# Altium project OpenPLCv0.2.0.PrjPcb (part 2 of 3)

## Sheet OpenPLCv0.2.0_Watchdog.SchDoc
size 420 x 297 mm; PageSetup: Record=PageOptions|CenterHorizontal=True|CenterVertical=True|PrintScale=1.01|XCorrection=1.00|YCorrection=1.00|PrintKind=1|BorderSize=5000000|LeftOffset=0|BottomOffset=0|Orientation=2|PaperLength=1000|PaperWidth=1000|Scale=100|PaperSource=7|PrintQuality=-4|MediaType=1|DitherType=10|PaperKind=A3|PrintScaleMode=1; DocumentNumber: 20; SheetNumber: 20; SheetTotal: 22; SheetTitle: Watchdog Timer
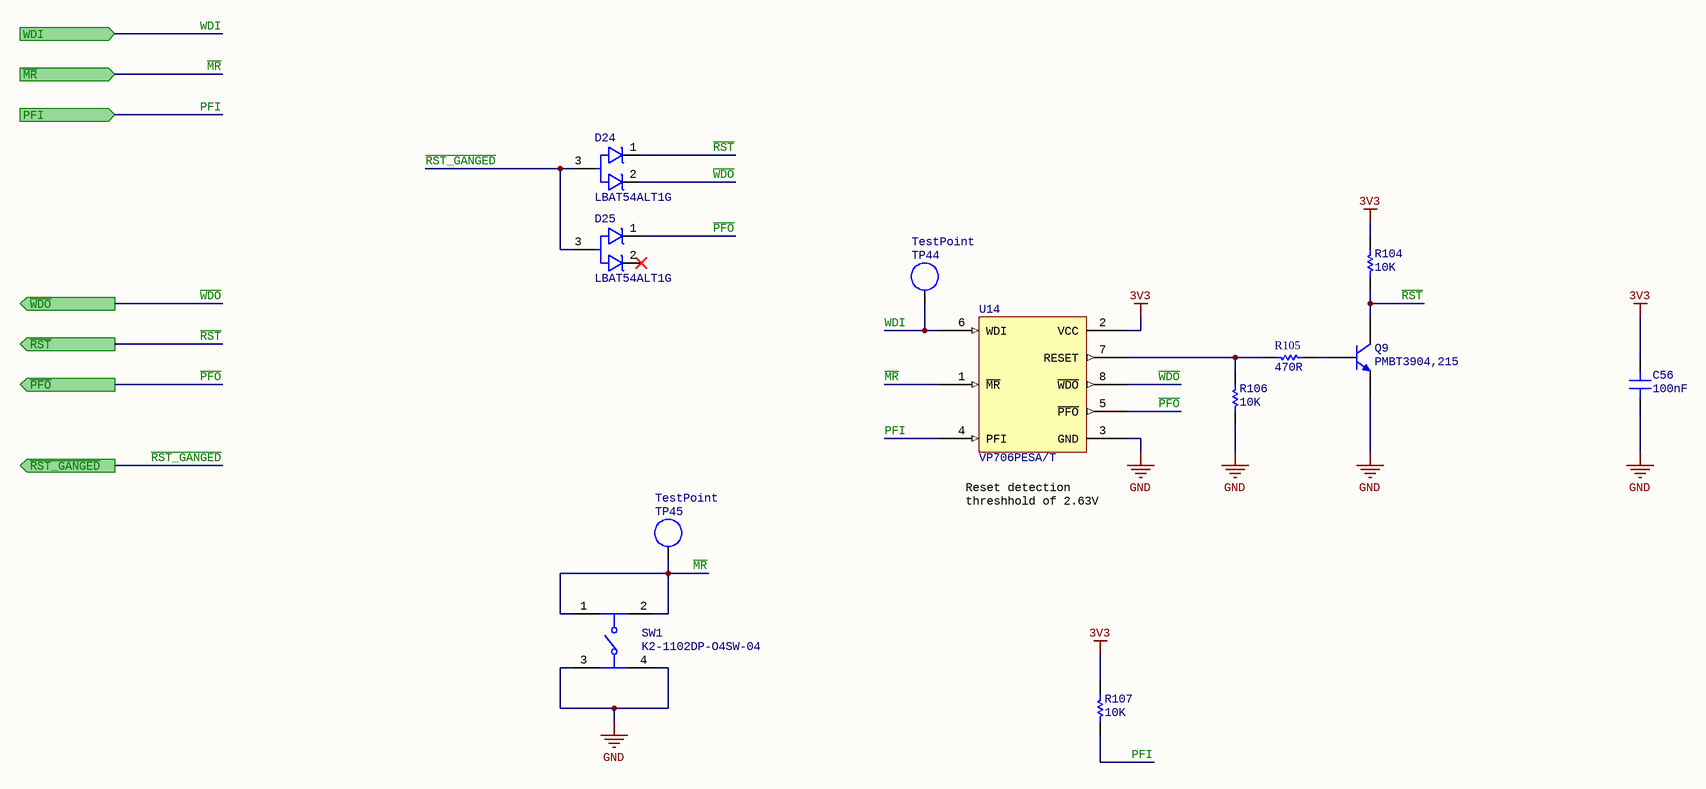
[diagram p8: OpenPLCv0.2.0_Watchdog.SchDoc]

### Parts
C56  Capacitance: 100nF  [SMD_CAP_0402(1005)_N]  (hidden comment: CC0402KRX5R6BB104)
D24  LBAT54ALT1G  [SOT23-3]
D25  LBAT54ALT1G  [SOT23-3]
Q9  PMBT3904,215  [SOT23-3]
R104  Resistance: 10K  [SMD_RES_0402(1005)_N]  (hidden comment: RC0402FR-0710KL)
R105  Resistance: 470R  [SMD_RES_0402(1005)_N]  (hidden comment: RC0402FR-07470RL)
R106  Resistance: 10K  [SMD_RES_0402(1005)_N]  (hidden comment: RC0402FR-0710KL)
R107  Resistance: 10K  [SMD_RES_0402(1005)_N]  (hidden comment: RC0402FR-0710KL)
SW1  K2-1102DP-O4SW-04  [K2-1102DP-O4SW-04]
TP44  TestPoint  [Pad]  (no BOM)
TP45  TestPoint  [Pad]  (no BOM)
U14  VP706PESA/T  [SOIC-8-3.9mm]

### Ports
PFI (in), WDI (in), ~{MR} (in), ~{PFO} (out), ~{RST_GANGED} (out), ~{RST} (out), ~{WDO} (out)

### Nets
3V3: C56.2 R104.2 R107.2 U14.2(VCC)
GND: C56.1 Q9.2(E) R106.1 SW1.3 SW1.4 U14.3(GND)
~{MR}: SW1.1 SW1.2 TP45.1 U14.1(~{MR}) ; port ~{MR}
~{PFO}: D25.1(CATHODE) U14.5(~{PFO}) ; port ~{PFO}
PFI: R107.1 U14.4(PFI) ; port PFI
~{RST}: D24.1(CATHODE) Q9.3(C) R104.1 ; port ~{RST}
~{RST_GANGED}: D24.3(ANODE) D25.3(ANODE) ; port ~{RST_GANGED}  [project net ~{RESET}]
~{WDO}: D24.2(CATHODE) U14.8(~{WDO}) ; port ~{WDO}
WDI: TP44.1 U14.6(WDI) ; port WDI  [project net LED]
NetQ9_1: Q9.1(B) R105.2
NetR105_1: R105.1 R106.2 U14.7(RESET)

Not connected (* = marked no-connect by the designer): D25 2(CATHODE)*

### Notes on the sheet
- (near U14) Reset detection threshhold of 2.63V
- FILE NAME
- PROJECT
- TITLE
- REV
- AUTHOR
- SIZE
- SHEET
- DATE
- OF
- A3

### Library data of the parts
C56 = 100nF 0402 10V 10%: as C3 on sheet OpenPLCv0.2.0_AnalogueOutput; Package: 0402; Tolerance: 10%; Voltage Rating: 10V
D24 D25 = LBAT54ALT1G: 30V 200mA 320mV @ 1mA SOT-23(SOT-23-3) Schottky Barrier Diodes (SBD) RoHS
Q9 = PMBT3904,215: as Q10 on sheet OpenPLCv0.2.0_TopLevel
R104 R106 R107 = 10K 0402 1% 1/16W: as R79 on sheet OpenPLCv0.2.0_TopLevel; Package: 0402; Tolerance: 1%; Power Rating: 1/16W
R105 = 470R 0402 1% 1W: as R43 on sheet OpenPLCv0.2.0_ComputeModule; Package: 0402; Tolerance: 1%
SW1 = K2-1102DP-O4SW-04: 6x6x11mm Through Hole Tactile Switches ROHS
TP44 TP45 = Test point
U14 = VP706PESA/T: SIOC-8 Monitors & Reset Circuits ROHS, 2.63V, -40°C to 85°C (copy of MAX706P)

## Sheet OpenPLCv0.2.0_AnalogueInput.SchDoc
size 420 x 297 mm; PageSetup: Record=PageOptions|CenterHorizontal=True|CenterVertical=True|PrintScale=1.01|XCorrection=1.00|YCorrection=1.00|PrintKind=1|BorderSize=5000000|LeftOffset=0|BottomOffset=0|Orientation=2|PaperLength=1000|PaperWidth=1000|Scale=100|PaperSource=7|PrintQuality=-4|MediaType=1|DitherType=10|PaperKind=A3|PrintScaleMode=1; DocumentNumber: 5; SheetNumber: 5; SheetTotal: 22; SheetTitle: Analogue Input
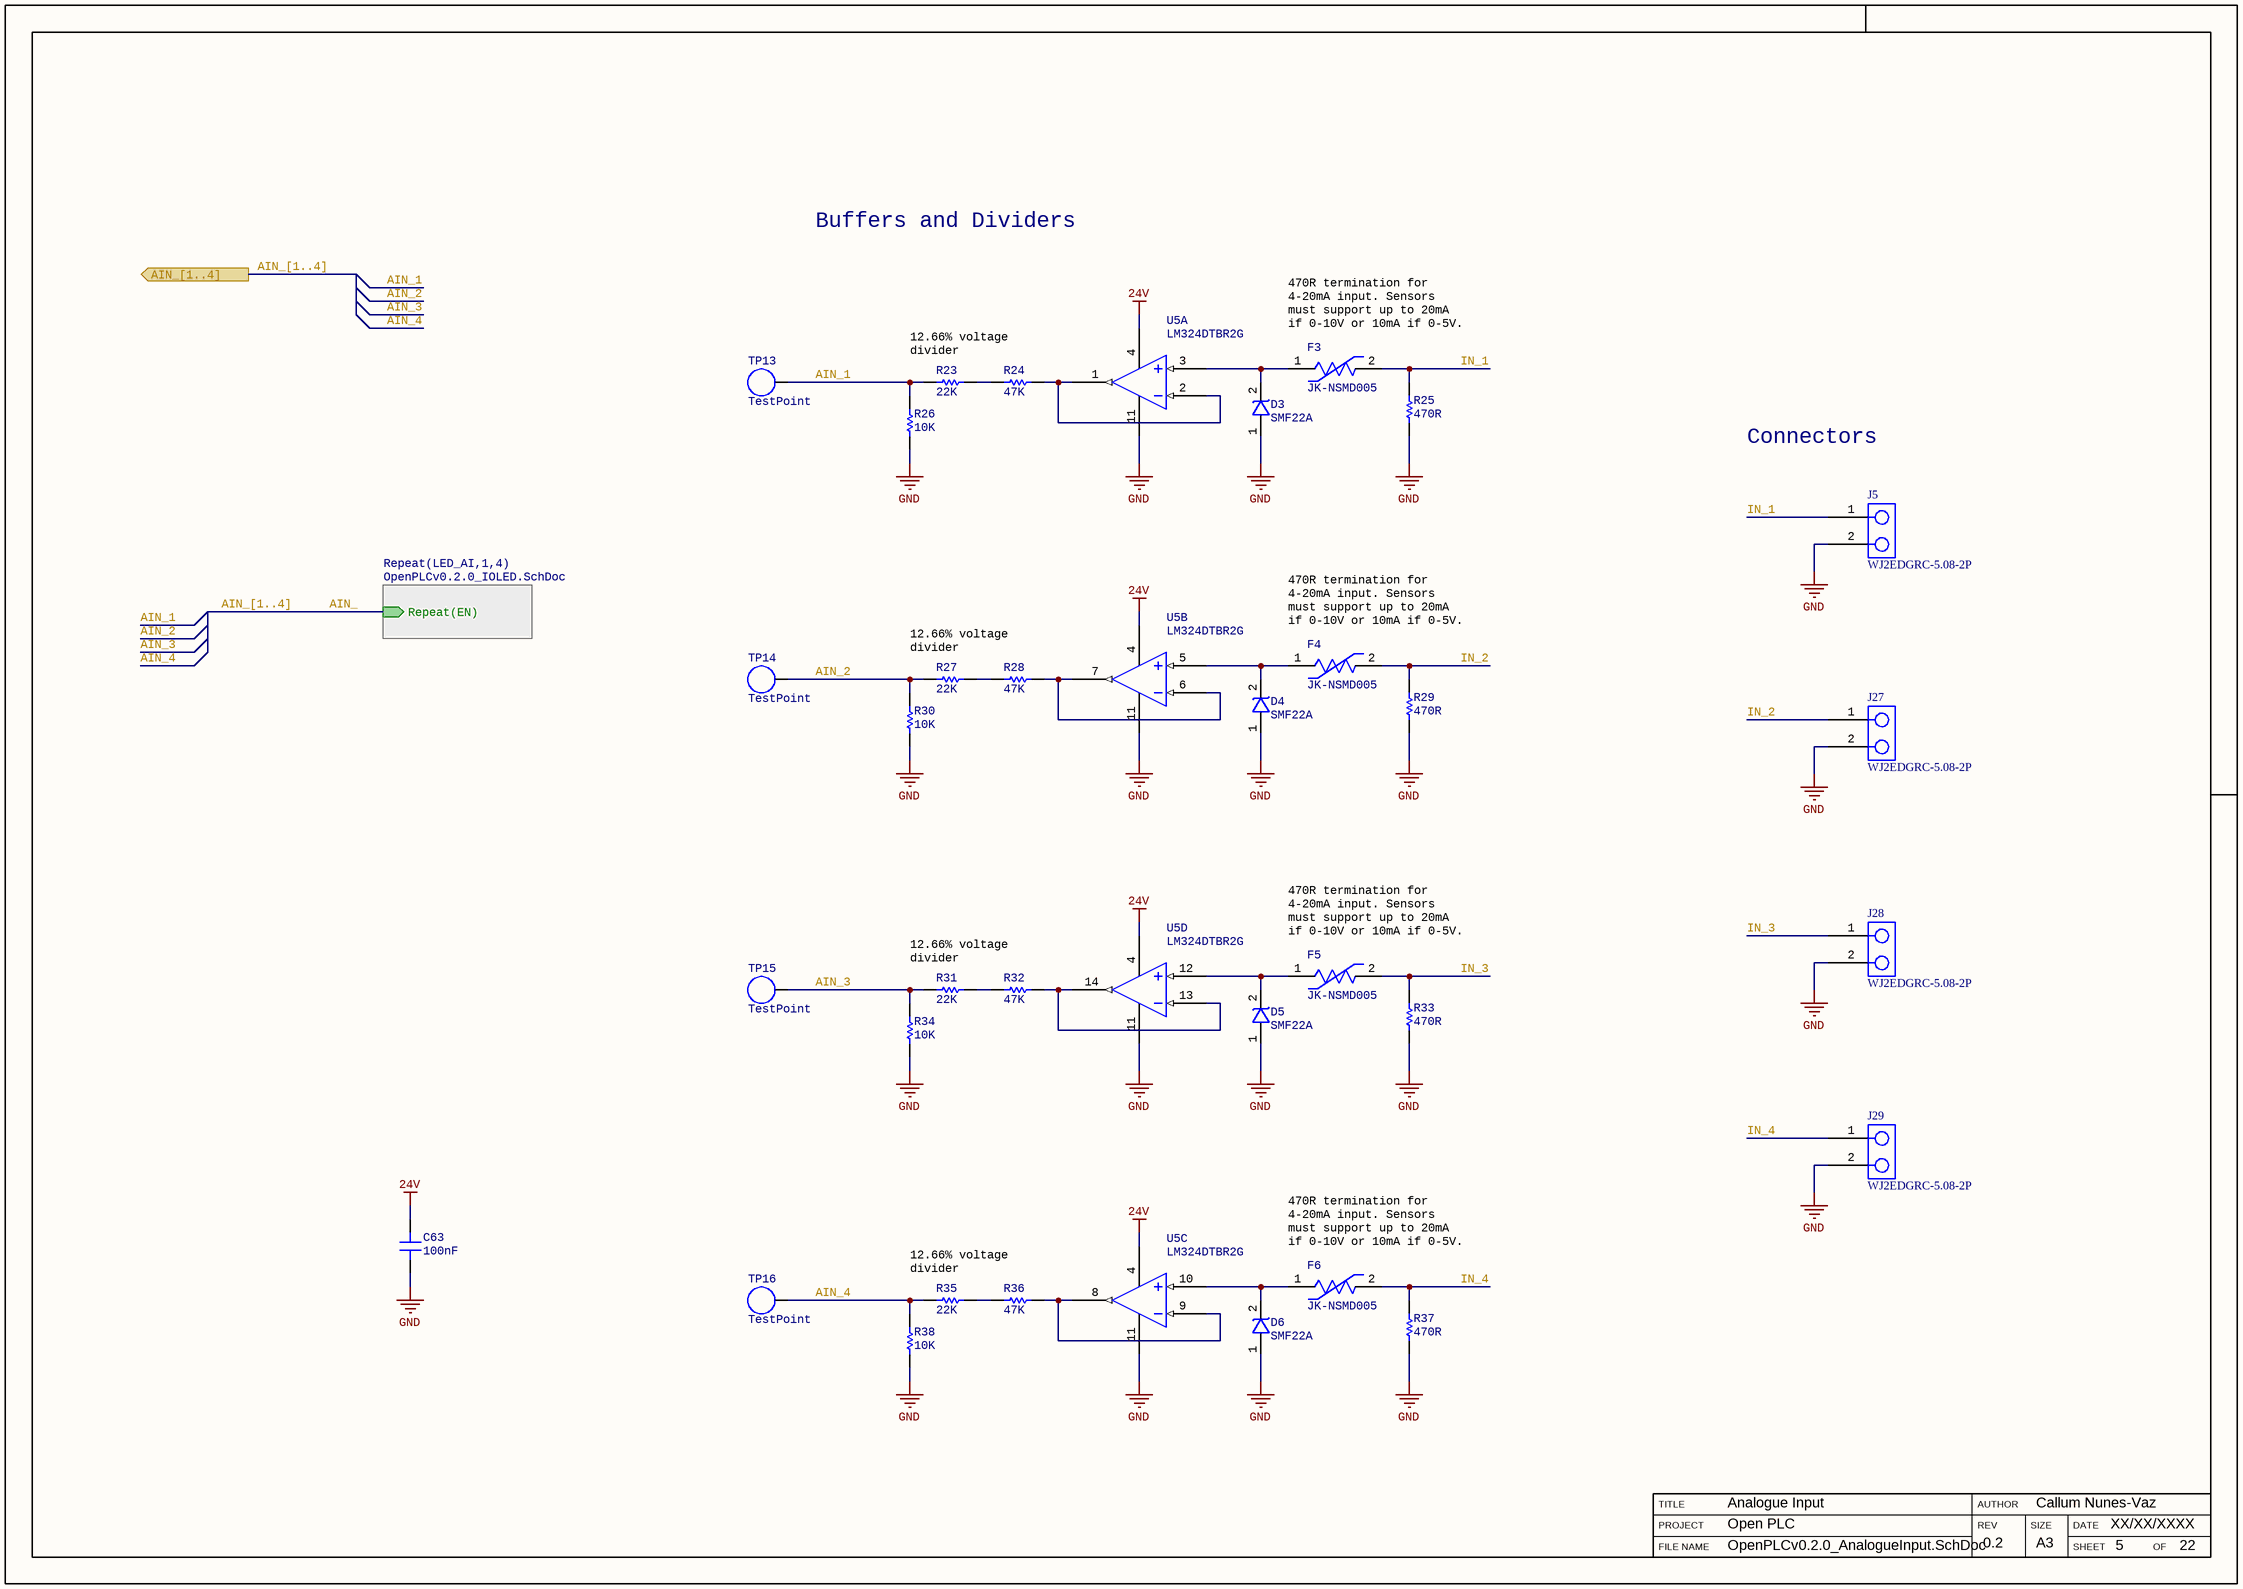
[diagram p9: OpenPLCv0.2.0_AnalogueInput.SchDoc]

### Parts
C63  Capacitance: 100nF  [SMD_CAP_0402(1005)_N]  (hidden comment: CC0402KRX5R9BB104)
D3  SMF22A  [SOD-123FL]
D4  SMF22A  [SOD-123FL]
D5  SMF22A  [SOD-123FL]
D6  SMF22A  [SOD-123FL]
F3  JK-NSMD005  [SMD_RES_1206(3216)_N]
F4  JK-NSMD005  [SMD_RES_1206(3216)_N]
F5  JK-NSMD005  [SMD_RES_1206(3216)_N]
F6  JK-NSMD005  [SMD_RES_1206(3216)_N]
J5  WJ2EDGRC-5.08-2P  [796638-2_BoardEdgeAlt]
J27  WJ2EDGRC-5.08-2P  [796638-2_BoardEdgeAlt]
J28  WJ2EDGRC-5.08-2P  [796638-2_BoardEdgeAlt]
J29  WJ2EDGRC-5.08-2P  [796638-2_BoardEdgeAlt]
R23  Resistance: 22K  [SMD_RES_0402(1005)_N]  (hidden comment: RC0402FR-0722KL)
R24  Resistance: 47K  [SMD_RES_0402(1005)_N]  (hidden comment: RC0402FR-0747KL)
R25  Resistance: 470R  [SMD_RES_2512(6432)_N]  (hidden comment: AC2512FK-07470RL)
R26  Resistance: 10K  [SMD_RES_0402(1005)_N]  (hidden comment: RC0402FR-0710KL)
R27  Resistance: 22K  [SMD_RES_0402(1005)_N]  (hidden comment: RC0402FR-0722KL)
R28  Resistance: 47K  [SMD_RES_0402(1005)_N]  (hidden comment: RC0402FR-0747KL)
R29  Resistance: 470R  [SMD_RES_2512(6432)_N]  (hidden comment: AC2512FK-07470RL)
R30  Resistance: 10K  [SMD_RES_0402(1005)_N]  (hidden comment: RC0402FR-0710KL)
R31  Resistance: 22K  [SMD_RES_0402(1005)_N]  (hidden comment: RC0402FR-0722KL)
R32  Resistance: 47K  [SMD_RES_0402(1005)_N]  (hidden comment: RC0402FR-0747KL)
R33  Resistance: 470R  [SMD_RES_2512(6432)_N]  (hidden comment: AC2512FK-07470RL)
R34  Resistance: 10K  [SMD_RES_0402(1005)_N]  (hidden comment: RC0402FR-0710KL)
R35  Resistance: 22K  [SMD_RES_0402(1005)_N]  (hidden comment: RC0402FR-0722KL)
R36  Resistance: 47K  [SMD_RES_0402(1005)_N]  (hidden comment: RC0402FR-0747KL)
R37  Resistance: 470R  [SMD_RES_2512(6432)_N]  (hidden comment: AC2512FK-07470RL)
R38  Resistance: 10K  [SMD_RES_0402(1005)_N]  (hidden comment: RC0402FR-0710KL)
TP13  TestPoint  [Pad]  (no BOM)
TP14  TestPoint  [Pad]  (no BOM)
TP15  TestPoint  [Pad]  (no BOM)
TP16  TestPoint  [Pad]  (no BOM)
U5  LM324DTBR2G  [TSSOP-14]  (parts A,B,C,D of 4)

### Sub-sheets
Repeat(LED_AI,1,4) = OpenPLCv0.2.0_IOLED.SchDoc: Repeat(EN) (in)

### Ports
AIN_[1..4] (out)

### Nets
24V: C63.2 U5.4(VDD)
GND: C63.1 D3.1(ANODE) D4.1(ANODE) D5.1(ANODE) D6.1(ANODE) J5.2 J27.2 J28.2 J29.2 R25.1 R26.2 R29.1 R30.2 R33.1 R34.2 R37.1 R38.2 U5.11(VSS)
AIN_: sheet Repeat(LED_AI,1,4)/Repeat(EN)
AIN_1: R23.1 R26.1 TP13.1  [project net ADC_IN1]
AIN_2: R27.1 R30.1 TP14.1  [project net ADC_IN2]
AIN_3: R31.1 R34.1 TP15.1  [project net ADC_IN3]
AIN_4: R35.1 R38.1 TP16.1  [project net ADC_IN4]
IN_1: F3.2 J5.1 R25.2
IN_2: F4.2 J27.1 R29.2
IN_3: F5.2 J28.1 R33.2
IN_4: F6.2 J29.1 R37.2
NetD3_2: D3.2(CATHODE) F3.1 U5.3(VIN+)
NetD4_2: D4.2(CATHODE) F4.1 U5.5(VIN+)
NetD5_2: D5.2(CATHODE) F5.1 U5.12(VIN+)
NetD6_2: D6.2(CATHODE) F6.1 U5.10(VIN+)
NetR23_2: R23.2 R24.2
NetR24_1: R24.1 U5.1(VOUT) U5.2(VIN-)
NetR27_2: R27.2 R28.2
NetR28_1: R28.1 U5.6(VIN-) U5.7(VOUT)
NetR31_2: R31.2 R32.2
NetR32_1: R32.1 U5.13(VIN-) U5.14(VOUT)
NetR35_2: R35.2 R36.2
NetR36_1: R36.1 U5.8(VOUT) U5.9(VIN-)

### Buses and harness runs
bus AIN_[1..4]
bus AIN_[1..4] = port AIN_[1..4]

### Notes on the sheet
- Buffers and Dividers
- (near F3) 470R termination for 4-20mA input. Sensors must support up to 20mA if 0-10V or 10mA if 0-5V.
- 12.66% voltage divider
- Connectors
- (near F4) 470R termination for 4-20mA input. Sensors must support up to 20mA if 0-10V or 10mA if 0-5V.
- (near F5) 470R termination for 4-20mA input. Sensors must support up to 20mA if 0-10V or 10mA if 0-5V.
- (near F6) 470R termination for 4-20mA input. Sensors must support up to 20mA if 0-10V or 10mA if 0-5V.
- FILE NAME
- PROJECT
- TITLE
- REV
- AUTHOR
- SIZE
- SHEET
- DATE
- OF
- A3

### Library data of the parts
C63 = 100nF 0402 50V 10%: 100nF ±10% 50V X5R 0402 Multilayer Ceramic Capacitors MLCC - SMD/SMT RoHS; Package: 0402; Tolerance: 10%; Voltage Rating: 50V
D3-D6 = SMF22A: Unidirectional 22V 24.4V 35.5V 5.6A SOD-123F TVS RoHS
F3-F6 = JK-NSMD005: 60V 150mA 1.5s 1206 PTC Resettable Fuses RoHS
J5 J27-J29 = WJ2EDGRC-5.08-2P: Covered（4Sided） 2 1 0.200"（5.08mm） 2 P=5.08mm Pluggable System Terminal Block RoHS
R23 R27 R31 R35 = 22K 0402 1% 1/16W: 22kΩ ±1% 1/16W ±100ppm/℃ 0402 Chip Resistor - Surface Mount RoHS; Package: 0402; Tolerance: 1%; Power Rating: 1/16W
R24 R28 R32 R36 = 47K 0402 1% 1/16W: 47kΩ ±1% 1/16W ±100ppm/℃ 0402 Chip Resistor - Surface Mount RoHS; Package: 0402; Tolerance: 1%; Power Rating: 1/16W
R25 R29 R33 R37 = 470R 2512 1% 1W: 470Ω ±1% 1W ±100ppm/℃ 2512 Chip Resistor - Surface Mount RoHS; Package: 2512; Tolerance: 1%; Power Rating: 1W
R26 R30 R34 R38 = 10K 0402 1% 1/16W: 10kΩ ±1% 1/16W ±100ppm/℃ 0402 Chip Resistor - Surface Mount RoHS; Package: 0402; Tolerance: 1%; Power Rating: 1/16W
TP13-TP16 = Test point
U5 = LM324DTBR2G: General Purpose 4 3V ~ 32V, ±1.5V ~ 16V 1MHz 0.6 V/us TSSOP-14 Operational Amplifiers RoHS

## Sheet OpenPLCv0.2.0_Power.SchDoc
size 420 x 297 mm; PageSetup: Record=PageOptions|CenterHorizontal=True|CenterVertical=True|PrintScale=1.01|XCorrection=1.00|YCorrection=1.00|PrintKind=1|BorderSize=5000000|LeftOffset=0|BottomOffset=0|Orientation=2|PaperLength=1000|PaperWidth=1000|Scale=100|PaperSource=7|PrintQuality=-4|MediaType=1|DitherType=10|PaperKind=A3|PrintScaleMode=1; DocumentNumber: 3; SheetNumber: 3; SheetTotal: 22; SheetTitle: Power Regulation
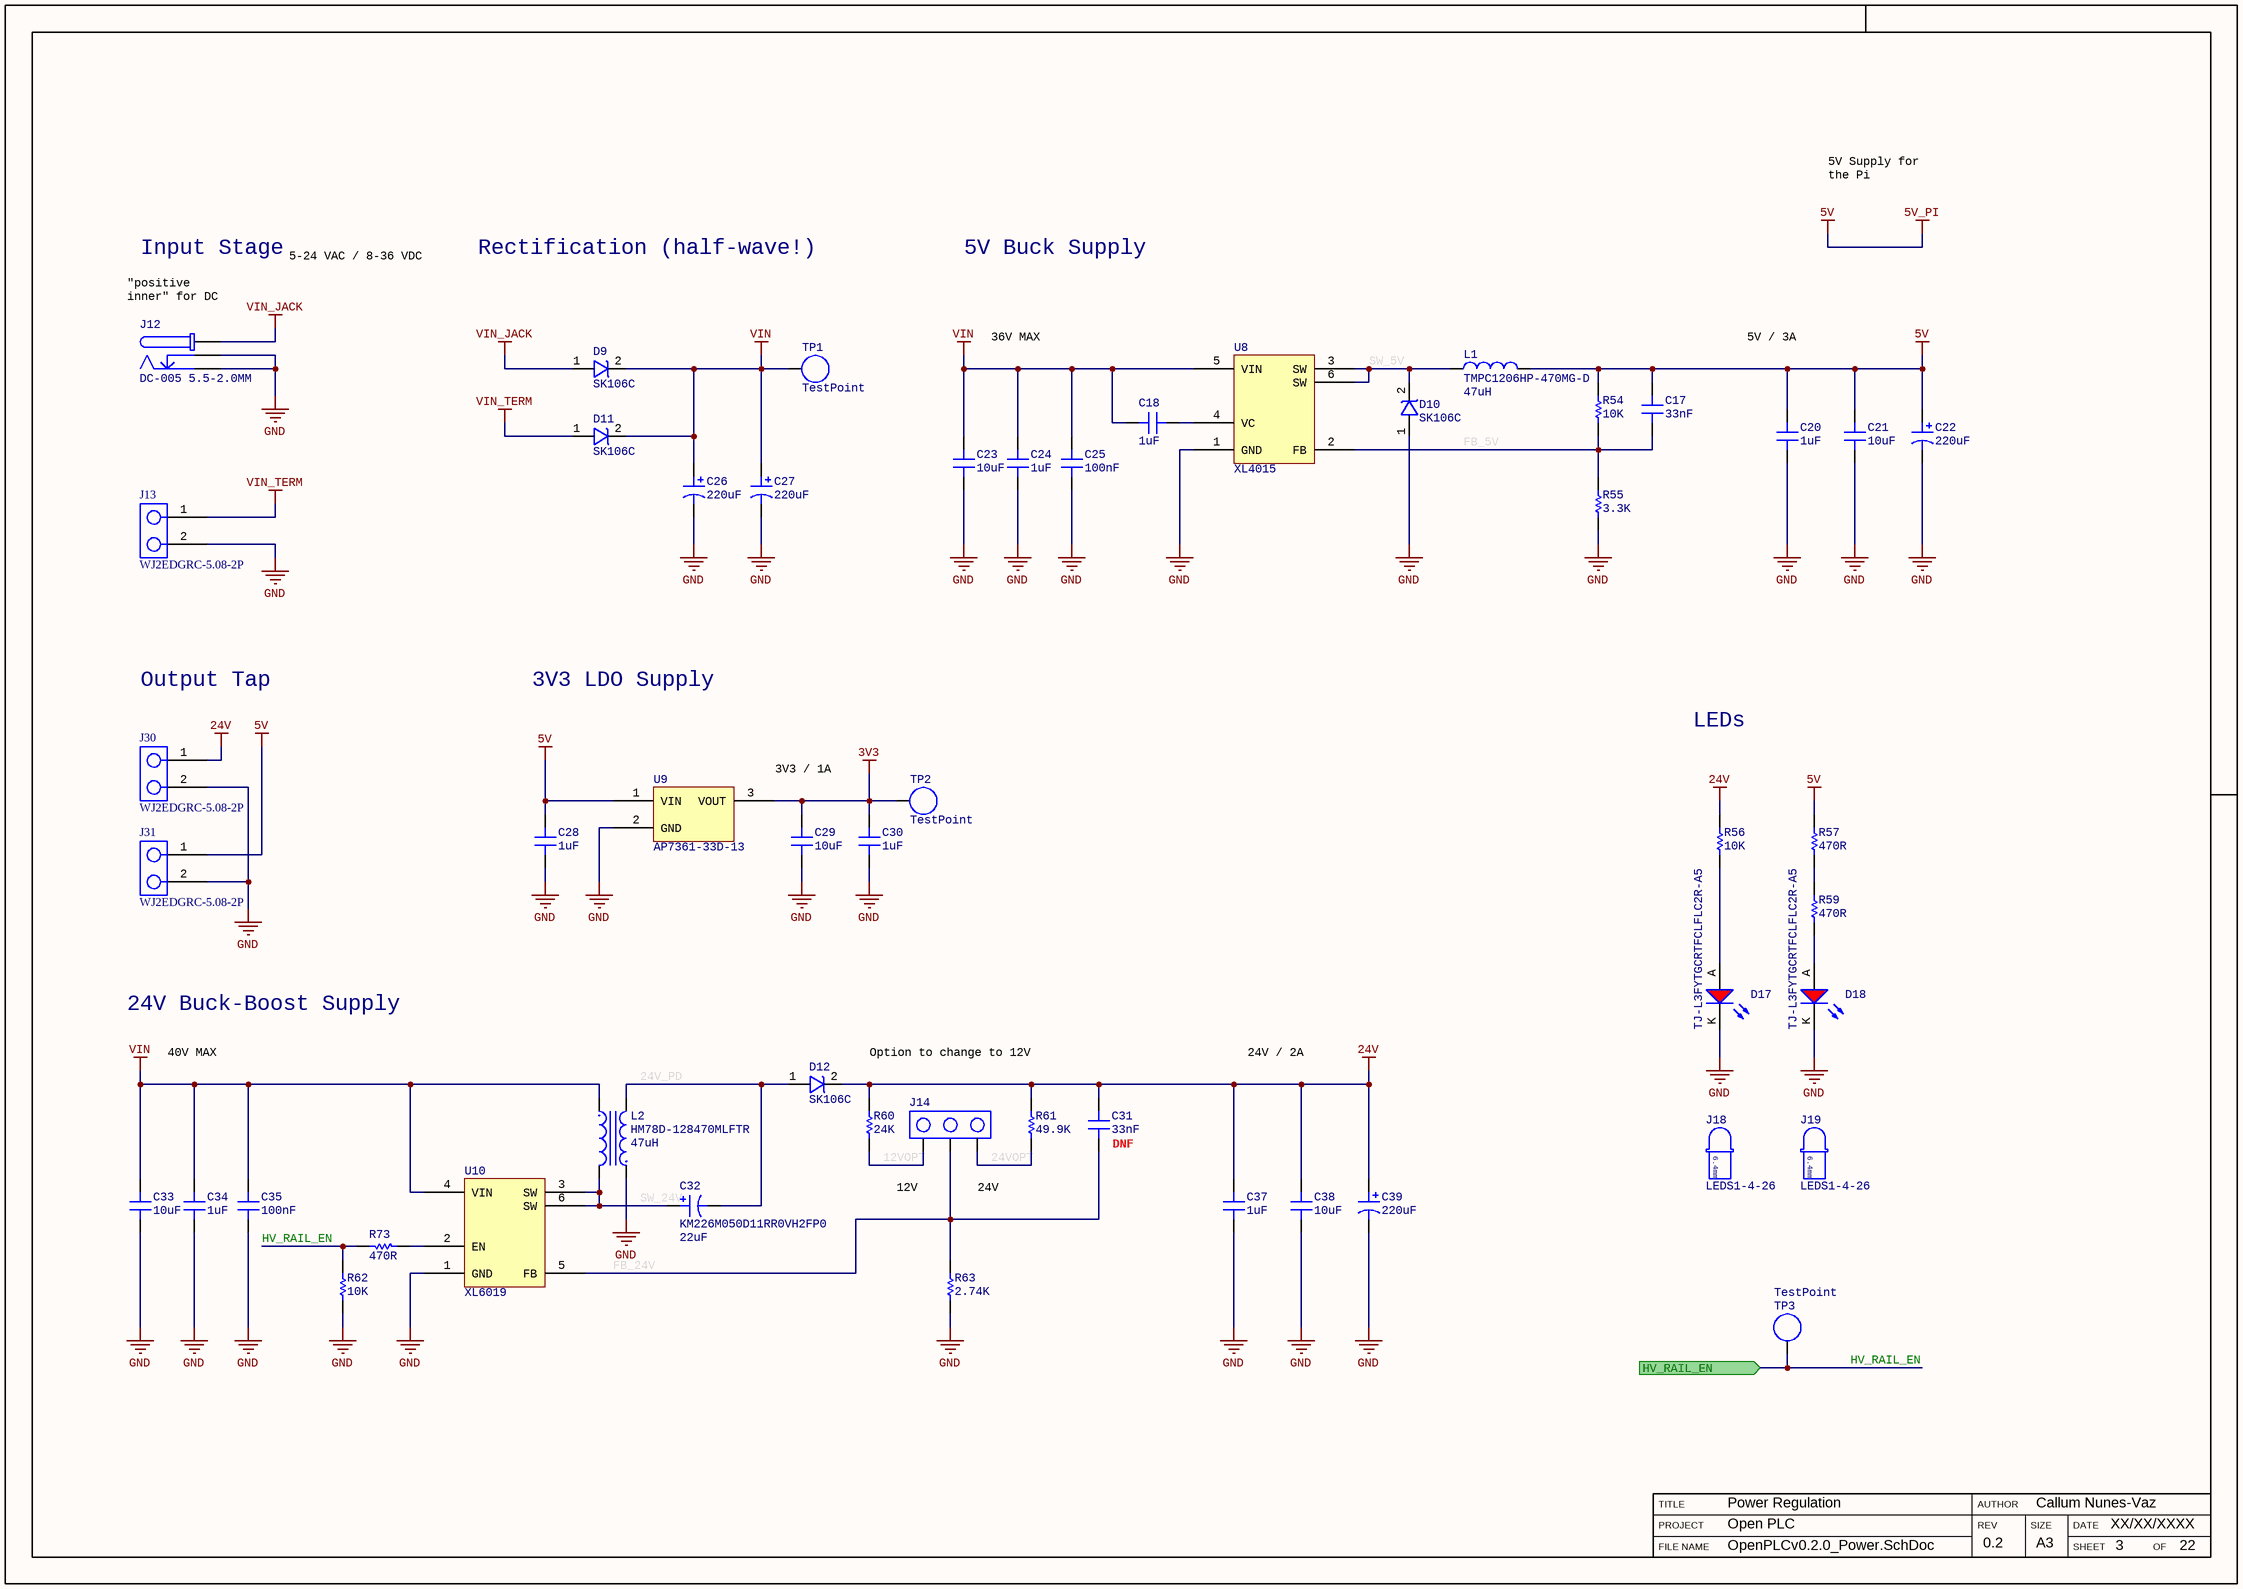
[diagram p10: OpenPLCv0.2.0_Power.SchDoc]

### Parts
C17  Capacitance: 33nF  [SMD_CAP_0402(1005)_N]  (hidden comment: CC0402KRX7R9BB333)
C18  Capacitance: 1uF  [SMD_CAP_0603(0201)_N]  (hidden comment: CC0603KRX5R9BB105)
C20  Capacitance: 1uF  [SMD_CAP_0603(0201)_N]  (hidden comment: CC0603KRX5R9BB105)
C21  Capacitance: 10uF  [SMD_CAP_1206(3216)_N]  (hidden comment: CC1206KKX5R9BB106)
C22  Capacitance: 220uF  [Electrolytic_D10mm_H12.5mm]  (hidden comment: ECR1HPT221MLL100012)
C23  Capacitance: 10uF  [SMD_CAP_1206(3216)_N]  (hidden comment: CC1206KKX5R9BB106)
C24  Capacitance: 1uF  [SMD_CAP_0603(0201)_N]  (hidden comment: CC0603KRX5R9BB105)
C25  Capacitance: 100nF  [SMD_CAP_0402(1005)_N]  (hidden comment: CC0402KRX5R9BB104)
C26  Capacitance: 220uF  [Electrolytic_D10mm_H12.5mm]  (hidden comment: ECR1HPT221MLL100012)
C27  Capacitance: 220uF  [Electrolytic_D10mm_H12.5mm]  (hidden comment: ECR1HPT221MLL100012)
C28  Capacitance: 1uF  [SMD_CAP_0603(0201)_N]  (hidden comment: CC0603KRX5R9BB105)
C29  Capacitance: 10uF  [SMD_CAP_1206(3216)_N]  (hidden comment: CC1206KKX5R9BB106)
C30  Capacitance: 1uF  [SMD_CAP_0603(0201)_N]  (hidden comment: CC0603KRX5R9BB105)
C31  Capacitance: 33nF  [SMD_CAP_0402(1005)_N]  (hidden comment: CC0402KRX7R9BB333)
C32  KM226M050D11RR0VH2FP0  Capacitance: 22uF  [Electrolytic_D5mm_H11mm]
C33  Capacitance: 10uF  [SMD_CAP_1206(3216)_N]  (hidden comment: CC1206KKX5R9BB106)
C34  Capacitance: 1uF  [SMD_CAP_0603(0201)_N]  (hidden comment: CC0603KRX5R9BB105)
C35  Capacitance: 100nF  [SMD_CAP_0402(1005)_N]  (hidden comment: CC0402KRX5R9BB104)
C37  Capacitance: 1uF  [SMD_CAP_0603(0201)_N]  (hidden comment: CC0603KRX5R9BB105)
C38  Capacitance: 10uF  [SMD_CAP_1206(3216)_N]  (hidden comment: CC1206KKX5R9BB106)
C39  Capacitance: 220uF  [Electrolytic_D10mm_H12.5mm]  (hidden comment: ECR1HPT221MLL100012)
D9  SK106C  [DO-214AB]
D10  SK106C  [DO-214AB]
D11  SK106C  [DO-214AB]
D12  SK106C  [DO-214AB]
D17  TJ-L3FYTGCRTFCLFLC2R-A5  [LED_3MM_SPACED_6.4MM_RED]
D18  TJ-L3FYTGCRTFCLFLC2R-A5  [LED_3MM_SPACED_6.4MM_RED]
J12  DC-005 5.5-2.0MM  [DC-005 5.5-2.0MM]
J13  WJ2EDGRC-5.08-2P  [796638-2_BoardEdgeAlt]
J14  12251103CNG0S115001  [Header_3POS]  (value not drawn)
J18  LEDS1-4-26  [3MM_LED_SPACER_6.4MM]
J19  LEDS1-4-26  [3MM_LED_SPACER_6.4MM]
J30  WJ2EDGRC-5.08-2P  [796638-2_BoardEdgeAlt]
J31  WJ2EDGRC-5.08-2P  [796638-2_BoardEdgeAlt]
L1  TMPC1206HP-470MG-D  Inductance: 47uH  [TMPC1206HP-470MG-D]
L2  HM78D-128470MLFTR  Parallel Inductance: 47uH  [HM78D-128470MLFTR]
R54  Resistance: 10K  [SMD_RES_0402(1005)_N]  (hidden comment: RC0402FR-0710KL)
R55  Resistance: 3.3K  [SMD_RES_0402(1005)_N]  (hidden comment: RC0402FR-073K3L)
R56  Resistance: 10K  [SMD_RES_0402(1005)_N]  (hidden comment: RC0402FR-0710KL)
R57  Resistance: 470R  [SMD_RES_0402(1005)_N]  (hidden comment: RC0402FR-07470RL)
R59  Resistance: 470R  [SMD_RES_0402(1005)_N]  (hidden comment: RC0402FR-07470RL)
R60  Resistance: 24K  [SMD_RES_0402(1005)_N]  (hidden comment: RC0402FR-0724KL)
R61  Resistance: 49.9K  [SMD_RES_0402(1005)_N]  (hidden comment: RC0402FR-0749K9L)
R62  Resistance: 10K  [SMD_RES_0402(1005)_N]  (hidden comment: RC0402FR-0710KL)
R63  Resistance: 2.74K  [SMD_RES_0402(1005)_N]  (hidden comment: RC0402FR-072K74L)
R73  Resistance: 470R  [SMD_RES_0402(1005)_N]  (hidden comment: RC0402FR-07470RL)
TP1  TestPoint  [Pad]  (no BOM)
TP2  TestPoint  [Pad]  (no BOM)
TP3  TestPoint  [Pad]  (no BOM)
U8  XL4015  [TO-263-5]
U9  AP7361-33D-13  [TO-252]
U10  XL6019  [TO-263-5]

### Ports
HV_RAIL_EN (in)

### Nets
3V3: C29.2 C30.2 TP2.1 U9.3(VOUT)
5V: C17.2 C20.2 C21.2 C22.1 C28.2 J31.1 L1.2 R54.2 R57.2 U9.1(VIN)  [also labelled 5V_PI]
24V: C31.2 C37.2 C38.2 C39.1 D12.2(CATHODE) J30.1 R56.2 R60.2 R61.2
GND: C20.1 C21.1 C22.2 C23.1 C24.1 C25.1 C26.2 C27.2 C28.1 C29.1 C30.1 C33.1 C34.1 C35.1 C37.1 C38.1 C39.2 D10.1(ANODE) D17.K D18.K J12.2 J12.3 J13.2 J30.2 J31.2 L2.1 R55.1 R62.1 R63.1 U8.1(GND) U9.2(GND) U10.1(GND)
VIN: C18.2 C23.2 C24.2 C25.2 C26.1 C27.1 C33.2 C34.2 C35.2 D9.2(CATHODE) D11.2(CATHODE) L2.2 TP1.1 U8.5(VIN) U10.4(VIN)
VIN_JACK: D9.1(ANODE) J12.4
VIN_TERM: D11.1(ANODE) J13.1
12VOPT: J14.1 R60.1
24V_PD: C32.2 D12.1(ANODE) L2.3
24VOPT: J14.3 R61.1
FB_5V: C17.1 R54.1 R55.2 U8.2(FB)
FB_24V: C31.1 J14.2 R63.2 U10.5(FB)
HV_RAIL_EN: R62.2 R73.1 TP3.1 ; port HV_RAIL_EN  [project net EXP_GPIO5]
SW_5V: D10.2(CATHODE) L1.1 U8.3(SW) U8.6(SW)
SW_24V: C32.1 L2.4 U10.3(SW) U10.6(SW)
NetC18_1: C18.1 U8.4(VC)
NetD17_A: D17.A R56.1
NetD18_A: D18.A R59.1
NetR57_1: R57.1 R59.2
NetR73_2: R73.2 U10.2(EN)

### Notes on the sheet
- 5V Supply for the Pi
- Input Stage
- 5-24 VAC / 8-36 VDC
- Rectification (half-wave!)
- 5V Buck Supply
- (near J12) "positive inner" for DC Supplies
- 36V MAX
- 5V / 3A
- Output Tap
- 3V3 LDO Supply
- LEDs
- 3V3 / 1A
- 24V Buck-Boost Supply
- 40V MAX
- Option to change to 12V
- 24V / 2A
- 12V
- 24V (default)
- (near C31) DNF
- FILE NAME
- PROJECT
- TITLE
- REV
- AUTHOR
- SIZE
- SHEET
- DATE
- OF
- A3
- (in symbol LEDS1-4-26) 6.4mm

### Library data of the parts
C17 C31 = 33nF 0402 50V 10%: 33nF ±10% 50V X7R 0402 Multilayer Ceramic Capacitors MLCC - SMD/SMT RoHS; Package: 0402; Tolerance: 10%; Voltage Rating: 50V
C18 C20 C24 C28 C30 C34 C37 = 1uF 0603 50V 10%: 1uF ±10% 50V X5R 0603 Multilayer Ceramic Capacitors MLCC - SMD/SMT RoHS; Package: 0603; Tolerance: 10%; Voltage Rating: 50V
C21 C23 C29 C33 C38 = 10uF 1206 50V 10%: 10uF ±10% 50V X5R 1206 Multilayer Ceramic Capacitors MLCC - SMD/SMT RoHS; Package: 1206; Tolerance: 10%; Voltage Rating: 50V
C22 C26 C27 C39 = ECR1HPT221MLL100012: 5mm 220uF 50V 12.5mm 2000hrs 85℃ ±20% 10mm Radial Leaded,10x12.5mm Aluminum Electrolytic Capacitors - Leaded ROHS; Voltage Max: 35V; Tolerance: 20%
C25 C35 = 100nF 0402 50V 10%: as C63 on sheet OpenPLCv0.2.0_AnalogueInput; Package: 0402; Tolerance: 10%; Voltage Rating: 50V
C32 = KM226M050D11RR0VH2FP0: 2mm 22uF 50V ±20% 5mm 11mm 79mA 120Hz 1000hrs 105℃ Radial Leaded,5x11mm Aluminum Electrolytic Capacitors - Leaded ROHS; Voltage Max: 35V; Tolerance: 20%
D9-D12 = SK106C: 60V 10A 850mV @ 10A SMC(DO-214AB) Schottky Barrier Diodes (SBD) RoHS
D17 D18 = TJ-L3FYTGCRTFCLFLC2R-A5: LED 3mm Red 620nm~630nm 1.8V~2.6V Through Hole Light Emitting Diodes (LED) RoHS C331031
J12 = DC-005 5.5-2.0MM: Through Hole AC/DC Power Plugs & Receptacles RoHS
J13 J30 J31 = WJ2EDGRC-5.08-2P: as J5 on sheet OpenPLCv0.2.0_AnalogueInput
J14 = 3-way Jumper: Pin Header 3 1 right-angle，180degrees 2.54mm Through Hole,P=2.54mm Pin Header & Female Header RoHS
J18 J19 = LEDS1-4-26: 3mm LED spacer 6.4mm height
L1 = TMPC1206HP-470MG-D: 47uH ±20% 5.5A 80mΩ SMD,13.5x12.5x5.7mm Power Inductors RoHS; Saturation Current: 7A; DC Resistance: 80mR; Current Max: 5.5A; Size: 13.5x12.5x5.7mm
L2 = HM78D-128470MLFTR: Coupled Inductors 47uH 20%; Current Max: 5.2A; DC Resistance: 90mR; Size: 12.5x12.5x8.05mm
R54 R56 R62 = 10K 0402 1% 1/16W: as R26 on sheet OpenPLCv0.2.0_AnalogueInput; Package: 0402; Tolerance: 1%; Power Rating: 1/16W
R55 = 3K3 0402 1% 1/16W: 3.3kΩ ±1% 1/16W ±100ppm/℃ 0402 Chip Resistor - Surface Mount RoHS; Package: 0402; Tolerance: 1%; Power Rating: 1/16W
R57 R59 R73 = 470R 0402 1% 1W: 470Ω ±1% 1/16W ±100ppm/℃ 0402 Chip Resistor - Surface Mount RoHS; Power Rating: 1W; Package: 0402; Tolerance: 1%
R60 = 24K 0402 1% 1/16W: 24kΩ ±1% 1/16W ±100ppm/℃ 0402 Chip Resistor - Surface Mount RoHS; Package: 0402; Tolerance: 1%; Power Rating: 1/16W
R61 = 49K9 0402 1% 1/16W: 49.9kΩ ±1% 1/16W ±100ppm/℃ 0402 Chip Resistor - Surface Mount RoHS; Package: 0402; Tolerance: 1%; Power Rating: 1/16W
R63 = 2K74 0402 1% 1/16W: 2.74kΩ ±1% 1/16W ±100ppm/℃ 0402 Chip Resistor - Surface Mount RoHS; Package: 0402; Tolerance: 1%; Power Rating: 1/16W
TP1-TP3 = Test point
U8 = XL4015: XLSEMI 5A 180KHz 36V Buck DC to DC Converter
U9 = AP7361-33D-13: Fixed 6V 3.3V 700mV @ 1A TO-252 Dropout Regulators(LDO) RoHS
U10 = XL6019: XLSEMI 180KHz 60V 5A Switching Current Boost / Buck-Boost / Inverting DC/DC Converter

## Sheet OpenPLCv0.2.0_USBPortTypeB.SchDoc
size 420 x 297 mm; PageSetup: Record=PageOptions|CenterHorizontal=True|CenterVertical=True|PrintScale=1.01|XCorrection=1.00|YCorrection=1.00|PrintKind=1|BorderSize=5000000|LeftOffset=0|BottomOffset=0|Orientation=2|PaperLength=1000|PaperWidth=1000|Scale=100|PaperSource=7|PrintQuality=-4|MediaType=1|DitherType=10|PaperKind=A3|PrintScaleMode=1; DocumentNumber: 16; SheetNumber: 16; SheetTotal: 22; SheetTitle: USB Type-B
Used 2 times, as channels USB_UFP_STM, USB_DFP_PI. Parts and nets are listed once, with the designators drawn on the sheet.
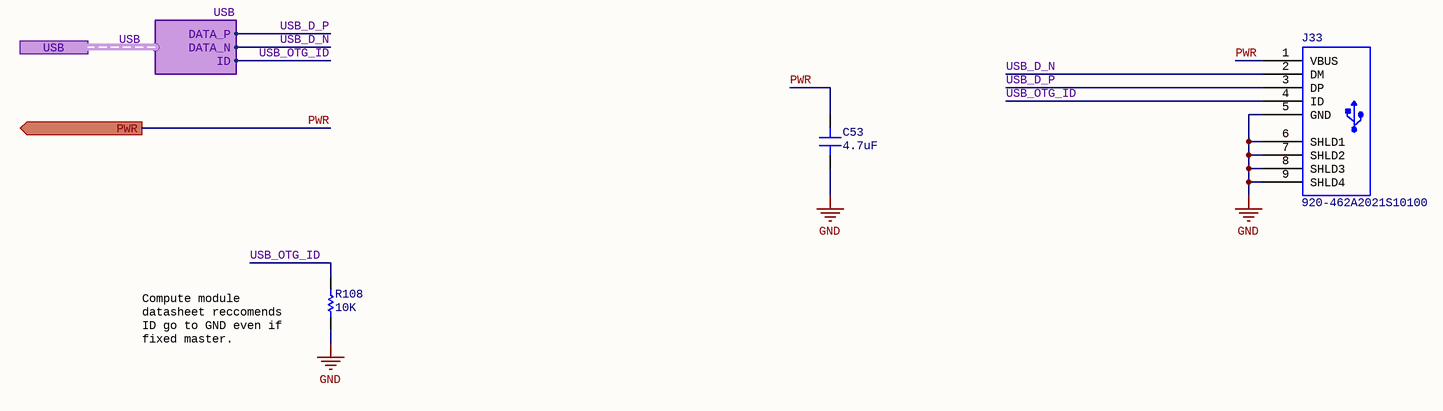
[diagram p11: OpenPLCv0.2.0_USBPortTypeB.SchDoc]

### Parts
C53  Capacitance: 4.7uF  [SMD_CAP_0603(0201)_N]  (hidden comment: CC0603KRX5R6BB475)
J33  920-462A2021S10100  [920-462A2021S10100]
R108  Resistance: 10K  [SMD_RES_0402(1005)_N]  (hidden comment: RC0402FR-0710KL)

### Ports
PWR (out), USB (harness USB)

### Harnesses
USB: DATA_P, DATA_N, ID

### Nets
GND: C53.1 J33.5(GND) J33.6(SHLD1) J33.7(SHLD2) J33.8(SHLD3) J33.9(SHLD4) R108.1
PWR: C53.2 J33.1(VBUS) ; port PWR
USB_D_N: J33.2(DM) ; port USB.DATA_N  [project net USB.DATA_N]
USB_D_P: J33.3(DP) ; port USB.DATA_P  [project net USB.DATA_P]
USB_OTG_ID: J33.4(ID) R108.2 ; port USB.ID  [project net USB.ID]

### Channels
USB_UFP_STM: designators end in _1; ports PWR=PWR_USB_UFP_STM
USB_DFP_PI: designators end in _2; ports PWR=PWR_USB_DFP_PI

### Buses and harness runs
harness USB = port USB

### Notes on the sheet
- (near R108) Compute module datasheet reccomends ID go to GND even if fixed master.
- FILE NAME
- PROJECT
- TITLE
- REV
- AUTHOR
- SIZE
- SHEET
- DATE
- OF
- A3

### Library data of the parts
C53 = 4.7uF 0603 10V 10%: 4.7uF ±10% 10V X5R 0603 Multilayer Ceramic Capacitors MLCC - SMD/SMT RoHS; Package: 0603; Tolerance: 10%; Voltage Rating: 10V
J33 = 920-462A2021S10100: USB - Mini B Female USB 2 5 SMD USB Connectors RoHS
R108 = 10K 0402 1% 1/16W: as R26 on sheet OpenPLCv0.2.0_AnalogueInput; Package: 0402; Tolerance: 1%; Power Rating: 1/16W

## Sheet OpenPLCv0.2.0_1Wire.SchDoc
size 420 x 297 mm; PageSetup: Record=PageOptions|CenterHorizontal=True|CenterVertical=True|PrintScale=1.01|XCorrection=1.00|YCorrection=1.00|PrintKind=1|BorderSize=5000000|LeftOffset=0|BottomOffset=0|Orientation=2|PaperLength=1000|PaperWidth=1000|Scale=100|PaperSource=7|PrintQuality=-4|MediaType=1|DitherType=10|PaperKind=A3|PrintScaleMode=1; DocumentNumber: 8; SheetNumber: 8; SheetTotal: 22; SheetTitle: 1-Wire Interface
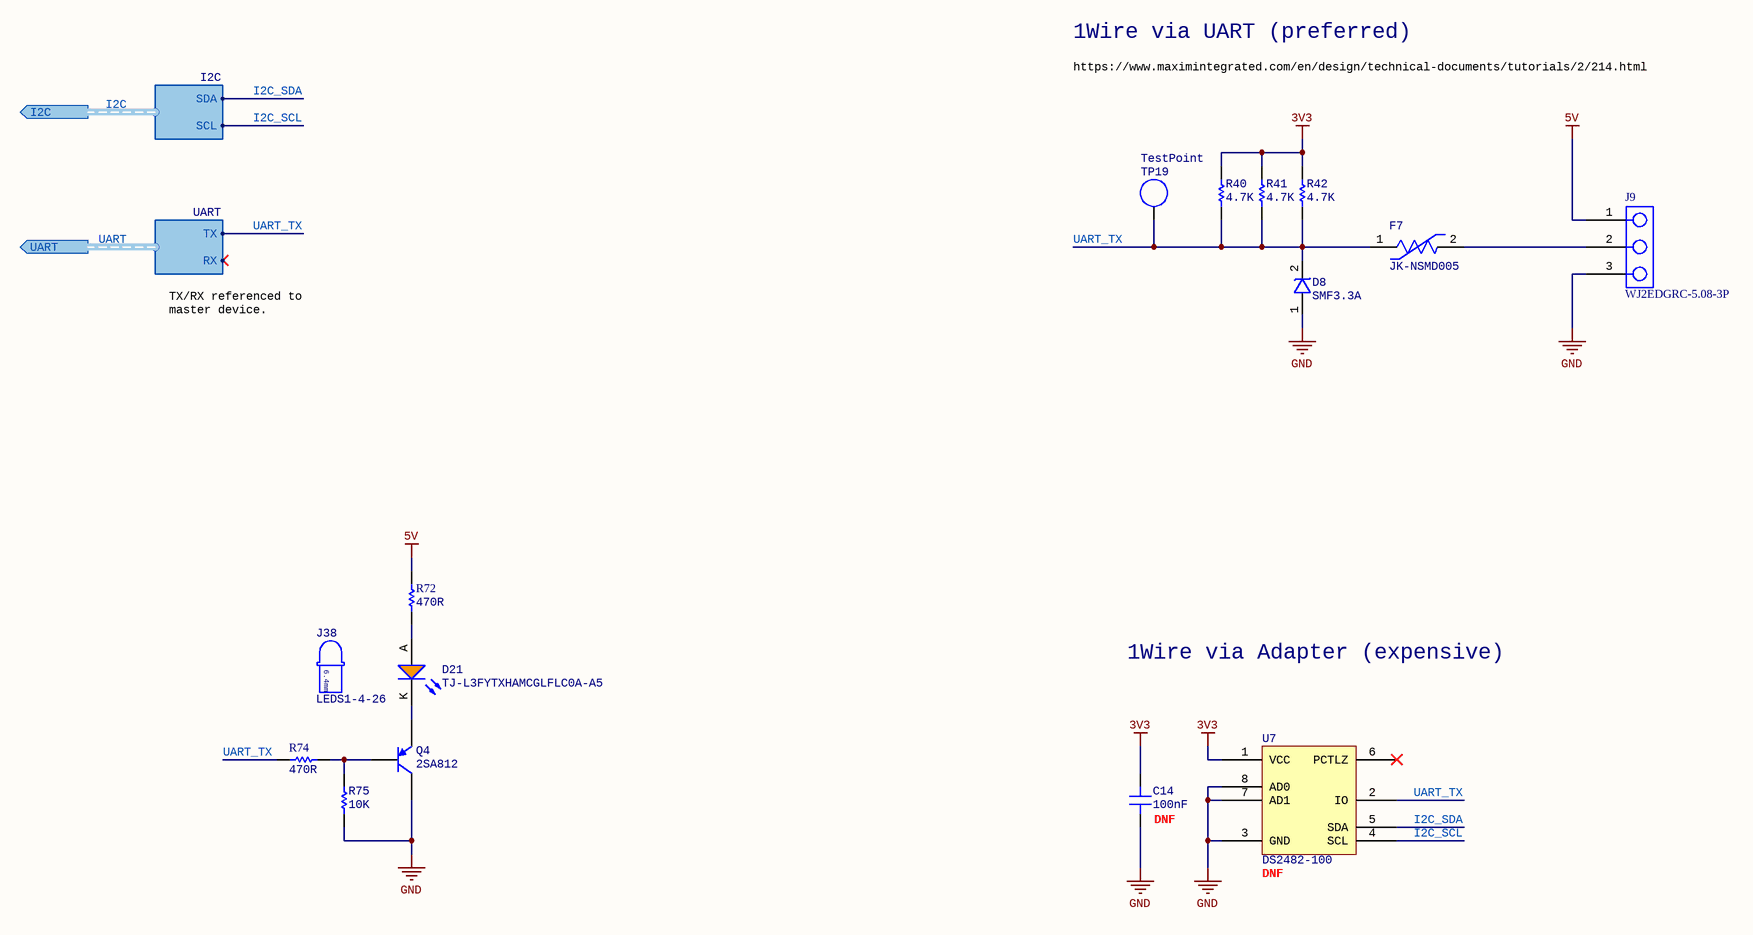
[diagram p12: OpenPLCv0.2.0_1Wire.SchDoc]

### Parts
C14  Capacitance: 100nF  [SMD_CAP_0402(1005)_N]  (hidden comment: CC0402KRX5R6BB104)
D8  SMF3.3A  [SOD-123FL]
D21  TJ-L3FYTXHAMCGLFLC0A-A5  [LED_3MM_SPACED_6.4MM_YELLOW]
F7  JK-NSMD005  [SMD_RES_1206(3216)_N]
J9  WJ2EDGRC-5.08-3P  [796638-3_BoardEdgeAlt]
J38  LEDS1-4-26  [3MM_LED_SPACER_6.4MM]
Q4  2SA812  [SOT23-3]
R40  Resistance: 4.7K  [SMD_RES_0402(1005)_N]  (hidden comment: RC0402FR-074K7L)
R41  Resistance: 4.7K  [SMD_RES_0402(1005)_N]  (hidden comment: RC0402FR-074K7L)
R42  Resistance: 4.7K  [SMD_RES_0402(1005)_N]  (hidden comment: RC0402FR-074K7L)
R72  Resistance: 470R  [SMD_RES_0402(1005)_N]  (hidden comment: RC0402FR-07470RL)
R74  Resistance: 470R  [SMD_RES_0402(1005)_N]  (hidden comment: RC0402FR-07470RL)
R75  Resistance: 10K  [SMD_RES_0402(1005)_N]  (hidden comment: RC0402FR-0710KL)
TP19  TestPoint  [Pad]  (no BOM)
U7  DS2482-100  [SOIC-8-3.9mm]

### Ports
I2C (out, harness I2C), UART (out, harness UART)

### Harnesses
I2C: SDA, SCL
UART: TX, RX

### Nets
3V3: C14.2 R40.2 R41.2 R42.2 U7.1(VCC)
5V: J9.1 R72.2
GND: C14.1 D8.1(ANODE) J9.3 Q4.3(E) R75.1 U7.3(GND) U7.7(AD1) U7.8(AD0)
I2C_SCL: U7.4(SCL) ; port I2C.SCL  [project net I2C.SCL]
I2C_SDA: U7.5(SDA) ; port I2C.SDA  [project net I2C.SDA]
UART_TX: D8.2(CATHODE) F7.1 R40.1 R41.1 R42.1 R74.2 TP19.1 U7.2(IO) ; port UART.TX  [project net STM_UART3.TX]
NetD21_A: D21.A R72.1
NetD21_K: D21.K Q4.2(C)
NetF7_2: F7.2 J9.2
NetQ4_1: Q4.1(B) R74.1 R75.2

Not connected (* = marked no-connect by the designer): U7 6(PCTLZ)*

### Buses and harness runs
harness I2C = port I2C
harness UART = port UART

### Notes on the sheet
- 1Wire via UART (preferred)
- https://www.maximintegrated.com/en/design/technical-documents/tutorials/2/214.html
- TX/RX referenced to master device.
- 1Wire via Adapter (expensive)
- (near C14) DNF
- (near U7) DNF
- FILE NAME
- PROJECT
- TITLE
- REV
- AUTHOR
- SIZE
- SHEET
- DATE
- OF
- A3
- (in symbol LEDS1-4-26) 6.4mm

### Library data of the parts
C14 = 100nF 0402 10V 10%: 100nF ±10% 10V X5R 0402 Multilayer Ceramic Capacitors MLCC - SMD/SMT RoHS; Package: 0402; Tolerance: 10%; Voltage Rating: 10V
D8 = SMF3.3A: Unidirectional 3.3V 5.2V 8V 25A SOD-123 TVS RoHS
D21 = TJ-L3FYTXHAMCGLFLC0A-A5: 600nm~610nm 1.8V~2.6V - - Through Hole Light Emitting Diodes (LED) ROHS 3mm
F7 = JK-NSMD005: as F3-F6 on sheet OpenPLCv0.2.0_AnalogueInput
J9 = WJ2EDGRC-5.08-3P: Covered（4Sided） 3 1 0.200"（5.08mm） 3 P=5.08mm Pluggable System Terminal Block RoHS
J38 = LEDS1-4-26: 3mm LED spacer 6.4mm height
Q4 = 2SA812: SOT-23(SOT-23-3) Bipolar Transistors - BJT ROHS PNP
R40-R42 = 4K7 0402 1% 1/16W: 4.7kΩ ±1% 1/16W ±100ppm/℃ 0402 Chip Resistor - Surface Mount RoHS; Package: 0402; Tolerance: 1%; Power Rating: 1/16W
R72 R74 = 470R 0402 1% 1W: as R57 on sheet OpenPLCv0.2.0_Power; Package: 0402; Tolerance: 1%
R75 = 10K 0402 1% 1/16W: as R26 on sheet OpenPLCv0.2.0_AnalogueInput; Package: 0402; Tolerance: 1%; Power Rating: 1/16W
TP19 = Test point
U7 = DS2482-100: Single-Channel 1-Wire Master

## Sheet OpenPLCv0.2.0_GPIOExpander.SchDoc
size 420 x 297 mm; PageSetup: Record=PageOptions|CenterHorizontal=True|CenterVertical=True|PrintScale=1.01|XCorrection=1.00|YCorrection=1.00|PrintKind=1|BorderSize=5000000|LeftOffset=0|BottomOffset=0|Orientation=2|PaperLength=1000|PaperWidth=1000|Scale=100|PaperSource=7|PrintQuality=-4|MediaType=1|DitherType=10|PaperKind=A3|PrintScaleMode=1; DocumentNumber: 22; SheetNumber: 22; SheetTotal: 22; SheetTitle: GPIO Expander
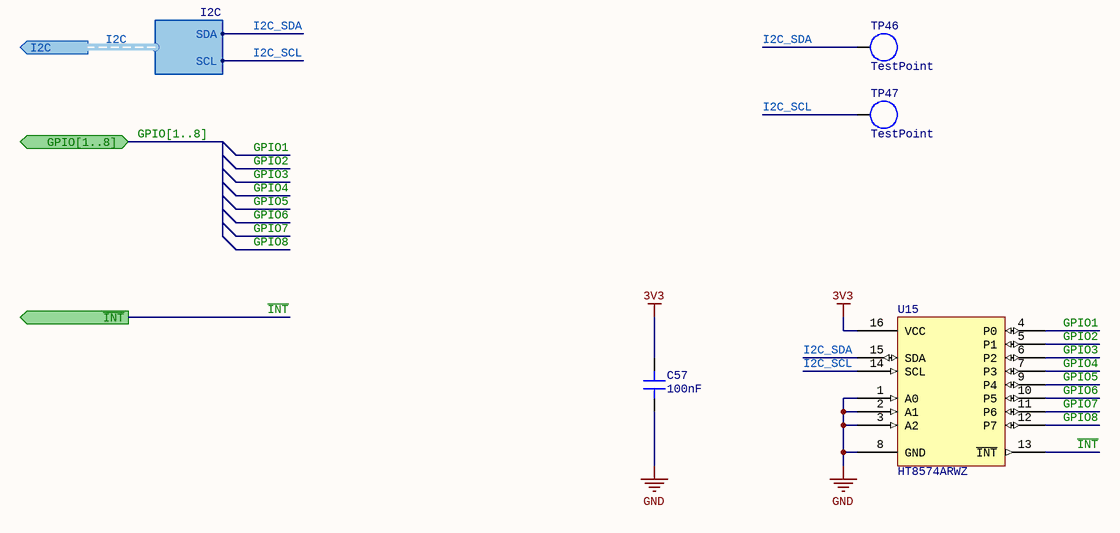
[diagram p13: OpenPLCv0.2.0_GPIOExpander.SchDoc]

### Parts
C57  Capacitance: 100nF  [SMD_CAP_0402(1005)_N]  (hidden comment: CC0402KRX5R6BB104)
TP46  TestPoint  [Pad]  (no BOM)
TP47  TestPoint  [Pad]  (no BOM)
U15  HT8574ARWZ  [TSSOP-16]

### Ports
GPIO[1..8] (bidir), I2C (out, harness I2C), ~{INT} (out)

### Harnesses
I2C: SDA, SCL

### Nets
3V3: C57.2 U15.16(VCC)
GND: C57.1 U15.1(A0) U15.2(A1) U15.3(A2) U15.8(GND)
GPIO1: U15.4(P0)  [project net CV_CC_MODE_SEL_1]
GPIO2: U15.5(P1)  [project net CV_CC_MODE_SEL_2]
GPIO3: U15.6(P2)  [project net CV_CC_MODE_SEL_1]
GPIO4: U15.7(P3)  [project net CV_CC_MODE_SEL_2]
GPIO5: U15.9(P4)  [project net EXP_GPIO5]
GPIO6: U15.10(P5)  [project net DIR_ALT]
GPIO7: U15.11(P6)  [project net EXP_GPIO7]
GPIO8: U15.12(P7)  [project net EXP_GPIO8]
I2C_SCL: TP47.1 U15.14(SCL) ; port I2C.SCL  [project net I2C.SCL]
I2C_SDA: TP46.1 U15.15(SDA) ; port I2C.SDA  [project net I2C.SDA]
~{INT}: U15.13(~{INT}) ; port ~{INT}

### Buses and harness runs
bus GPIO[1..8] = port GPIO[1..8]
harness I2C = port I2C

### Notes on the sheet
- FILE NAME
- PROJECT
- TITLE
- REV
- AUTHOR
- SIZE
- SHEET
- DATE
- OF
- A3

### Library data of the parts
C57 = 100nF 0402 10V 10%: as C14 on sheet OpenPLCv0.2.0_1Wire; Package: 0402; Tolerance: 10%; Voltage Rating: 10V
TP46 TP47 = Test point
U15 = HT8574ARWZ: SOP16 Interface - I/O Expanders ROHS (PCF8754 clone)

## Sheet OpenPLCv0.2.0_RS485.SchDoc
size 420 x 297 mm; PageSetup: Record=PageOptions|CenterHorizontal=True|CenterVertical=True|PrintScale=1.01|XCorrection=1.00|YCorrection=1.00|PrintKind=1|BorderSize=5000000|LeftOffset=0|BottomOffset=0|Orientation=2|PaperLength=1000|PaperWidth=1000|Scale=100|PaperSource=7|PrintQuality=-4|MediaType=1|DitherType=10|PaperKind=A3|PrintScaleMode=1; DocumentNumber: 21; SheetNumber: 21; SheetTotal: 22; SheetTitle: RS485 Transceiver
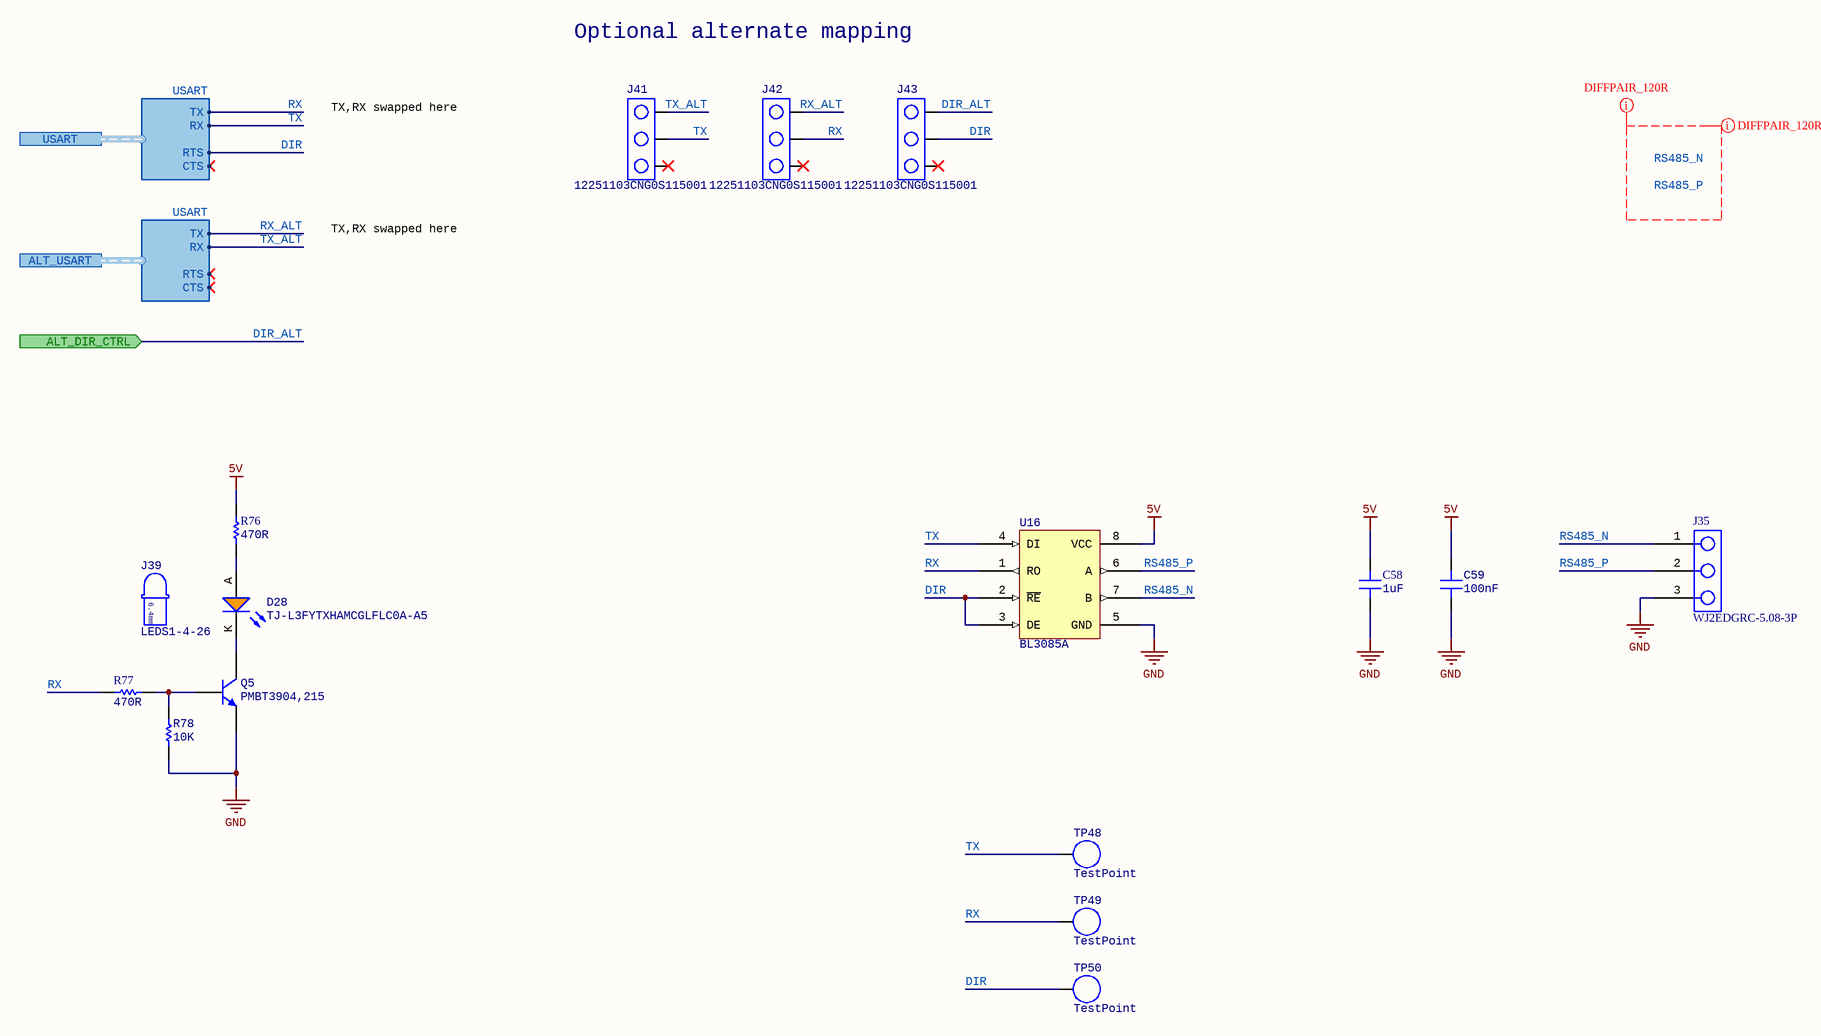
[diagram p14: OpenPLCv0.2.0_RS485.SchDoc]

### Parts
C58  Capacitance: 1uF  [SMD_CAP_0603(0201)_N]  (hidden comment: CC0603KRX5R9BB105)
C59  Capacitance: 100nF  [SMD_CAP_0402(1005)_N]  (hidden comment: CC0402KRX5R6BB104)
D28  TJ-L3FYTXHAMCGLFLC0A-A5  [LED_3MM_SPACED_6.4MM_YELLOW]
J35  WJ2EDGRC-5.08-3P  [796638-3_BoardEdgeAlt]
J39  LEDS1-4-26  [3MM_LED_SPACER_6.4MM]
J41  12251103CNG0S115001  [Header_3POS]
J42  12251103CNG0S115001  [Header_3POS]
J43  12251103CNG0S115001  [Header_3POS]
Q5  PMBT3904,215  [SOT23-3]
R76  Resistance: 470R  [SMD_RES_0402(1005)_N]  (hidden comment: RC0402FR-07470RL)
R77  Resistance: 470R  [SMD_RES_0402(1005)_N]  (hidden comment: RC0402FR-07470RL)
R78  Resistance: 10K  [SMD_RES_0402(1005)_N]  (hidden comment: RC0402FR-0710KL)
TP48  TestPoint  [Pad]  (no BOM)
TP49  TestPoint  [Pad]  (no BOM)
TP50  TestPoint  [Pad]  (no BOM)
U16  BL3085A  [SOIC-8-3.9mm]

### Ports
ALT_DIR_CTRL (in), ALT_USART (harness USART), USART (harness USART)

### Harnesses
USART: TX, RX, RTS, CTS

### Nets
5V: C58.2 C59.2 R76.2 U16.8(VCC)
GND: C58.1 C59.1 J35.3 Q5.2(E) R78.1 U16.5(GND)
DIR: J43.2 TP50.1 U16.2(~{RE}) U16.3(DE) ; port USART.RTS
DIR_ALT: J43.1 ; port ALT_DIR_CTRL
RS485_N: J35.1 U16.7(B)
RS485_P: J35.2 U16.6(A)
RX: J42.2 R77.2 TP49.1 U16.1(RO) ; port USART.TX  [project net GPIO8]
RX_ALT: J42.1 ; port ALT_USART.TX  [project net GPIO4]
TX: J41.2 TP48.1 U16.4(DI) ; port USART.RX  [project net GPIO9]
TX_ALT: J41.1 ; port ALT_USART.RX  [project net GPIO5]
NetD28_A: D28.A R76.1
NetD28_K: D28.K Q5.3(C)
NetQ5_1: Q5.1(B) R77.1 R78.2

Not connected (* = marked no-connect by the designer): J41 3*; J42 3*; J43 3*

### Layout directives
differential pair; differential pair class 120R_DIFF_PAIRS; net class 120R_PAIRS: RS485_N, RS485_P
mark named DIFFPAIR_120R: RS485_N, RS485_P

### Notes on the sheet
- Optional alternate mapping
- TX,RX swapped here
- Labels drawn without touching a wire or pin: RS485_N, RS485_P
- FILE NAME
- PROJECT
- TITLE
- REV
- AUTHOR
- SIZE
- SHEET
- DATE
- OF
- A3
- (in symbol LEDS1-4-26) 6.4mm

### Library data of the parts
C58 = 1uF 0603 50V 10%: as C18 on sheet OpenPLCv0.2.0_Power; Package: 0603; Tolerance: 10%; Voltage Rating: 50V
C59 = 100nF 0402 10V 10%: as C14 on sheet OpenPLCv0.2.0_1Wire; Package: 0402; Tolerance: 10%; Voltage Rating: 10V
D28 = TJ-L3FYTXHAMCGLFLC0A-A5: as D21 on sheet OpenPLCv0.2.0_1Wire
J35 = WJ2EDGRC-5.08-3P: as J9 on sheet OpenPLCv0.2.0_1Wire
J39 = LEDS1-4-26: 3mm LED spacer 6.4mm height
J41-J43 = 3-way Jumper: as J14 on sheet OpenPLCv0.2.0_Power
Q5 = PMBT3904,215: NPN 200mA 40V 250mW SOT-23(SOT-23-3) Transistors (NPN/PNP) RoHS
R76 R77 = 470R 0402 1% 1W: as R57 on sheet OpenPLCv0.2.0_Power; Package: 0402; Tolerance: 1%
R78 = 10K 0402 1% 1/16W: as R26 on sheet OpenPLCv0.2.0_AnalogueInput; Package: 0402; Tolerance: 1%; Power Rating: 1/16W
TP48-TP50 = Test point
U16 = BL3085A: SOIC-8_150mil RS-485/RS-422 ICs ROHS (MAX485 clone)

## Sheet OpenPLCv0.2.0_RTC.SchDoc
size 420 x 297 mm; PageSetup: Record=PageOptions|CenterHorizontal=True|CenterVertical=True|PrintScale=1.01|XCorrection=1.00|YCorrection=1.00|PrintKind=1|BorderSize=5000000|LeftOffset=0|BottomOffset=0|Orientation=2|PaperLength=1000|PaperWidth=1000|Scale=100|PaperSource=7|PrintQuality=-4|MediaType=1|DitherType=10|PaperKind=A3|PrintScaleMode=1; DocumentNumber: 6; SheetNumber: 6; SheetTotal: 22; SheetTitle: Real Time Clock
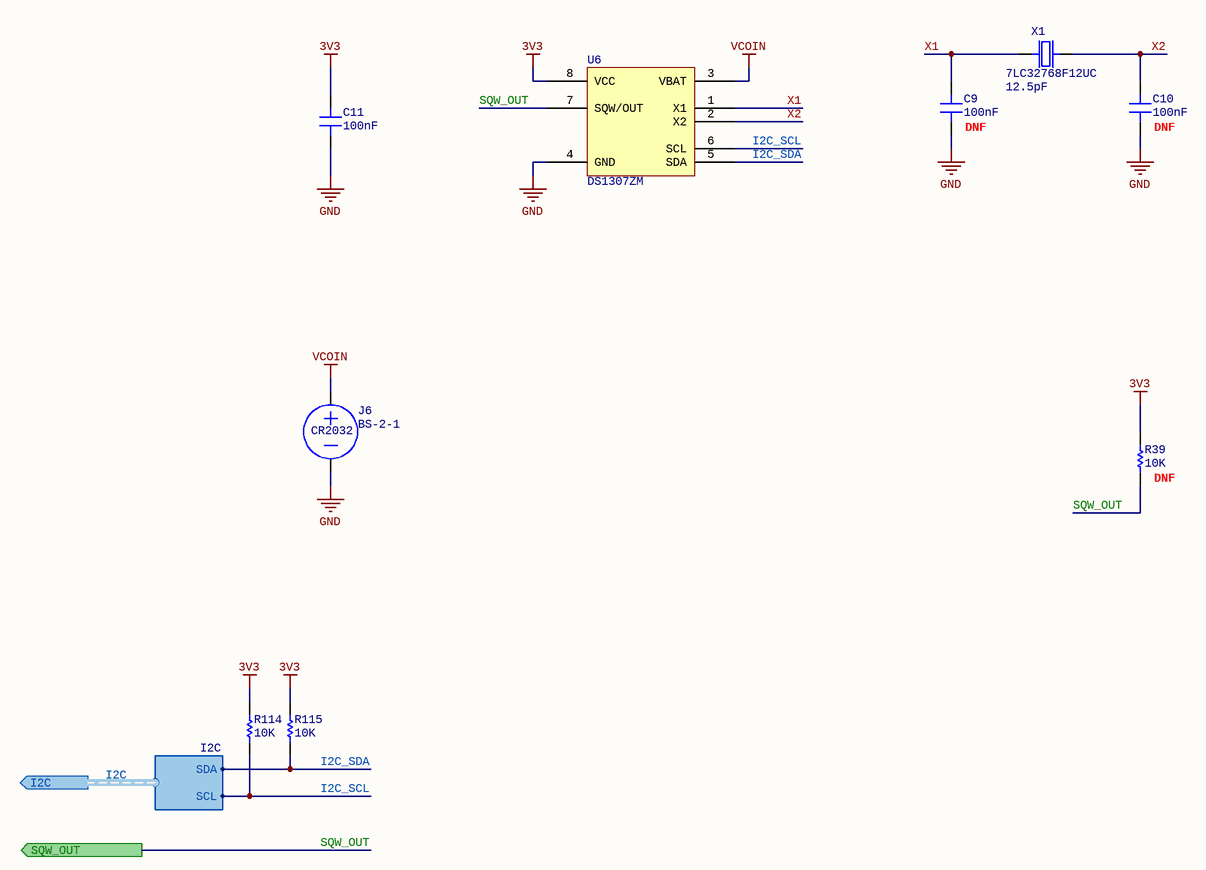
[diagram p15: OpenPLCv0.2.0_RTC.SchDoc]

### Parts
C9  Capacitance: 100nF  [SMD_CAP_0402(1005)_N]  (hidden comment: CC0402KRX5R9BB104)
C10  Capacitance: 100nF  [SMD_CAP_0402(1005)_N]  (hidden comment: CC0402KRX5R9BB104)
C11  Capacitance: 100nF  [SMD_CAP_0402(1005)_N]  (hidden comment: CC0402KRX5R6BB104)
J6  BS-2-1  [BS-2-1]
R39  Resistance: 10K  [SMD_RES_0402(1005)_N]  (hidden comment: RC0402FR-0710KL)
R114  Resistance: 10K  [SMD_RES_0402(1005)_N]  (hidden comment: RC0402FR-0710KL)
R115  Resistance: 10K  [SMD_RES_0402(1005)_N]  (hidden comment: RC0402FR-0710KL)
U6  DS1307ZM  [SOIC-8-3.9mm]
X1  7LC32768F12UC  Load capacitance: 12.5pF  [CRYSTAL_3215]

### Ports
I2C (out, harness I2C), SQW_OUT (out)

### Harnesses
I2C: SDA, SCL

### Nets
3V3: C11.2 R39.1 R114.2 R115.2 U6.8(VCC)
GND: C9.1 C10.1 C11.1 J6.2 U6.4(GND)
VCOIN: J6.1 U6.3(VBAT)
I2C_SCL: R114.1 U6.6(SCL) ; port I2C.SCL  [project net GPIO3]
I2C_SDA: R115.1 U6.5(SDA) ; port I2C.SDA  [project net GPIO2]
SQW_OUT: R39.2 U6.7(SQW/OUT) ; port SQW_OUT
X1: C9.2 U6.1(X1) X1.1
X2: C10.2 U6.2(X2) X1.2

### Buses and harness runs
harness I2C = port I2C

### Notes on the sheet
- (near C9) DNF
- (near C10) DNF
- (near R39) DNF
- FILE NAME
- PROJECT
- TITLE
- REV
- AUTHOR
- SIZE
- SHEET
- DATE
- OF
- A3
- (in symbol BS-2-1) CR2032

### Library data of the parts
C9 C10 = 100nF 0402 50V 10%: as C63 on sheet OpenPLCv0.2.0_AnalogueInput; Package: 0402; Tolerance: 10%; Voltage Rating: 50V
C11 = 100nF 0402 10V 10%: as C14 on sheet OpenPLCv0.2.0_1Wire; Package: 0402; Tolerance: 10%; Voltage Rating: 10V
J6 = BS-2-1: DIP Battery Box/Battery Holders ROHS
R39 R114 R115 = 10K 0402 1% 1/16W: as R26 on sheet OpenPLCv0.2.0_AnalogueInput; Package: 0402; Tolerance: 1%; Power Rating: 1/16W
U6 = DS1307ZM: HGSEMI SOP-8 Pre-ordered Chips RoHS
X1 = 7LC32768F12UC: 32.768KHz ±20ppm 12.5pF 70kΩ SMD-3215_2P SMD Crystal Resonators RoHS; Package: 3215

## Sheet OpenPLCv0.2.0_SDCard.SchDoc
size 420 x 297 mm; PageSetup: Record=PageOptions|CenterHorizontal=True|CenterVertical=True|PrintScale=1.01|XCorrection=1.00|YCorrection=1.00|PrintKind=1|BorderSize=5000000|LeftOffset=0|BottomOffset=0|Orientation=2|PaperLength=1000|PaperWidth=1000|Scale=100|PaperSource=7|PrintQuality=-4|MediaType=1|DitherType=10|PaperKind=A3|PrintScaleMode=1; DocumentNumber: 17; SheetNumber: 17; SheetTotal: 22; SheetTitle: SD Card Slot
Used 2 times, as channels SD_STG, SD_BOOT. Parts and nets are listed once, with the designators drawn on the sheet.
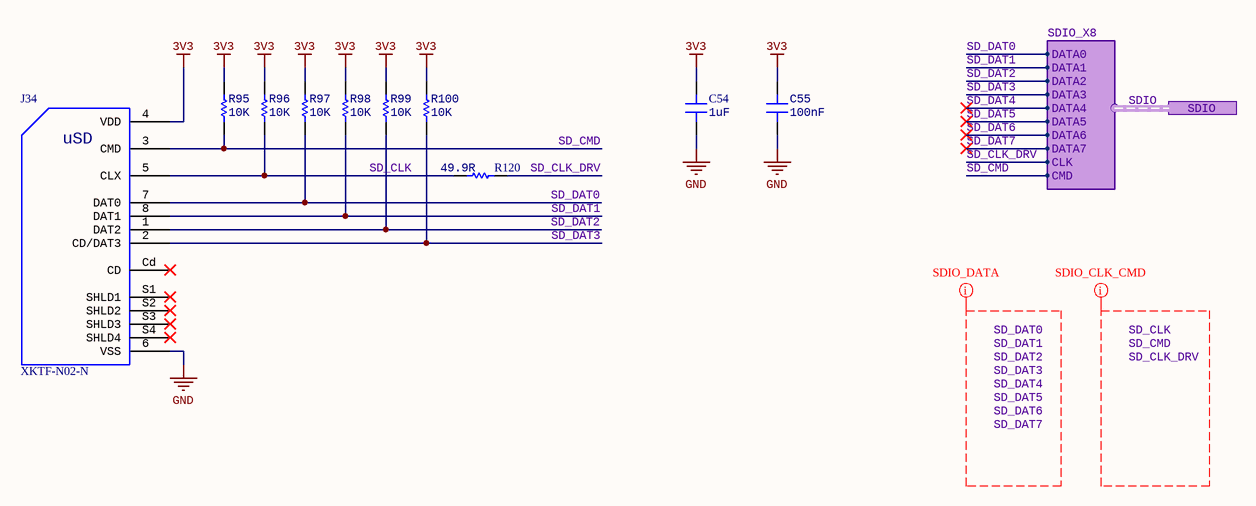
[diagram p16: OpenPLCv0.2.0_SDCard.SchDoc]

### Parts
C54  Capacitance: 1uF  [SMD_CAP_0603(0201)_N]  (hidden comment: CC0603KRX5R9BB105)
C55  Capacitance: 100nF  [SMD_CAP_0402(1005)_N]  (hidden comment: CC0402KRX5R6BB104)
J34  XKTF-N02-N  [XKTF-N02-N]
R95  Resistance: 10K  [SMD_RES_0402(1005)_N]  (hidden comment: RC0402FR-0710KL)
R96  Resistance: 10K  [SMD_RES_0402(1005)_N]  (hidden comment: RC0402FR-0710KL)
R97  Resistance: 10K  [SMD_RES_0402(1005)_N]  (hidden comment: RC0402FR-0710KL)
R98  Resistance: 10K  [SMD_RES_0402(1005)_N]  (hidden comment: RC0402FR-0710KL)
R99  Resistance: 10K  [SMD_RES_0402(1005)_N]  (hidden comment: RC0402FR-0710KL)
R100  Resistance: 10K  [SMD_RES_0402(1005)_N]  (hidden comment: RC0402FR-0710KL)
R120  Resistance: 49.9R  [SMD_RES_0402(1005)_N]  (hidden comment: RC0402FR-0749R9L)

### Ports
SDIO (harness SDIO_X8)

### Harnesses
SDIO_X8: DATA1, DATA0, DATA2, DATA3, DATA4, DATA5, DATA6, CMD, CLK, DATA7

### Nets
3V3: C54.2 C55.2 J34.4(VDD) R95.2 R96.2 R97.2 R98.2 R99.2 R100.2
GND: C54.1 C55.1 J34.6(VSS)
SD_CLK: J34.5(CLX) R96.1 R120.1
SD_CLK_DRV: R120.2 ; port SDIO.CLK
SD_CMD: J34.3(CMD) R95.1 ; port SDIO.CMD
SD_DAT0: J34.7(DAT0) R97.1 ; port SDIO.DATA0
SD_DAT1: J34.8(DAT1) R98.1 ; port SDIO.DATA1
SD_DAT2: J34.1(DAT2) R99.1 ; port SDIO.DATA2
SD_DAT3: J34.2(CD/DAT3) R100.1 ; port SDIO.DATA3
SD_DAT4: port SDIO.DATA4
SD_DAT5: port SDIO.DATA5
SD_DAT6: port SDIO.DATA6
SD_DAT7: port SDIO.DATA7

Not connected (* = marked no-connect by the designer): J34 Cd(CD)* S1(SHLD1)* S2(SHLD2)* S3(SHLD3)* S4(SHLD4)*

### Channels
SD_STG: designators end in _1
SD_BOOT: designators end in _2

### Buses and harness runs
harness SDIO = port SDIO

### Layout directives
net class SDIO_DATA: SD_DAT0, SD_DAT1, SD_DAT2, SD_DAT3, SD_DAT4, SD_DAT5, SD_DAT6, SD_DAT7
net class SDIO_CLK_CMD: SD_CLK, SD_CLK_DRV, SD_CMD

### Notes on the sheet
- Labels drawn without touching a wire or pin: SD_CLK, SD_CLK_DRV, SD_CMD, SD_DAT0, SD_DAT1, SD_DAT2, SD_DAT3, SD_DAT4, SD_DAT5, SD_DAT6, SD_DAT7
- FILE NAME
- PROJECT
- TITLE
- REV
- AUTHOR
- SIZE
- SHEET
- DATE
- OF
- A3
- (in symbol XKTF-N02-N) uSD

### Library data of the parts
C54 = 1uF 0603 50V 10%: as C18 on sheet OpenPLCv0.2.0_Power; Package: 0603; Tolerance: 10%; Voltage Rating: 50V
C55 = 100nF 0402 10V 10%: as C14 on sheet OpenPLCv0.2.0_1Wire; Package: 0402; Tolerance: 10%; Voltage Rating: 10V
J34 = XKTF-N02-N: XKB Enterprise XKTF-N02-N / SMD Card Sockets Connectors RoHS
R95-R100 = 10K 0402 1% 1/16W: as R26 on sheet OpenPLCv0.2.0_AnalogueInput; Package: 0402; Tolerance: 1%; Power Rating: 1/16W
R120 = 49R9 0402 1% 1/16W: 49.9Ω ±1% 1/16W ±100ppm/℃ 0402 Chip Resistor - Surface Mount RoHS; Package: 0402; Tolerance: 1%; Power Rating: 1/16W

## Sheet OpenPLCv0.2.0_Display.SchDoc
size 420 x 297 mm; PageSetup: Record=PageOptions|CenterHorizontal=True|CenterVertical=True|PrintScale=1.01|XCorrection=1.00|YCorrection=1.00|PrintKind=1|BorderSize=5000000|LeftOffset=0|BottomOffset=0|Orientation=2|PaperLength=1000|PaperWidth=1000|Scale=100|PaperSource=7|PrintQuality=-4|MediaType=1|DitherType=10|PaperKind=A3|PrintScaleMode=1; DocumentNumber: 7; SheetNumber: 7; SheetTotal: 22; SheetTitle: Display Outputs
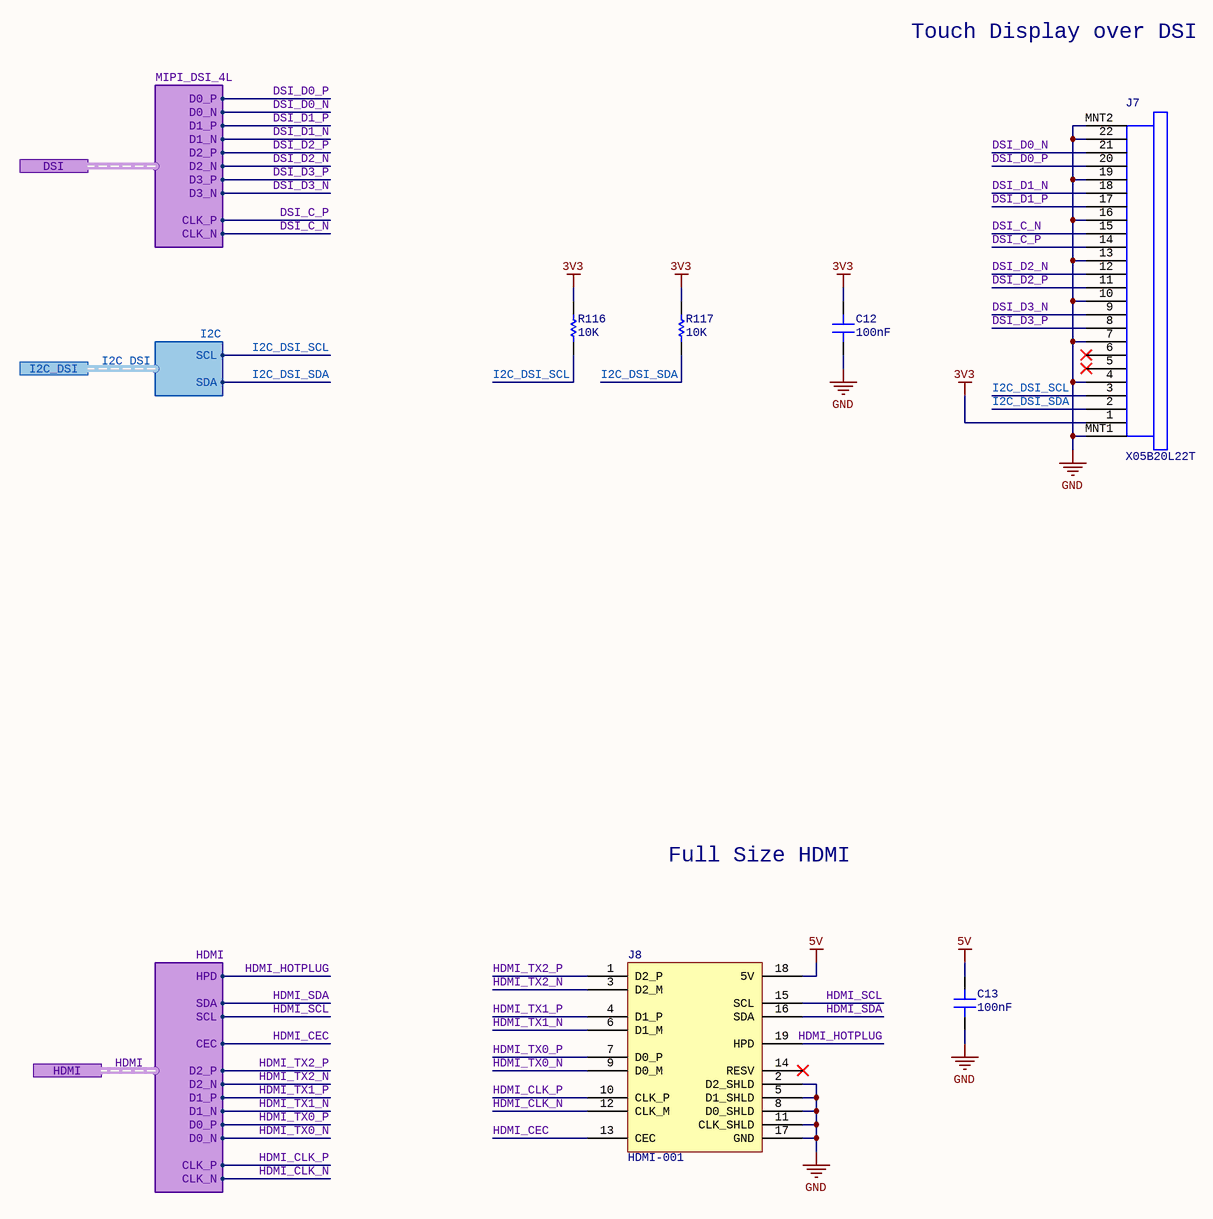
[diagram p17: OpenPLCv0.2.0_Display.SchDoc]

### Parts
C12  Capacitance: 100nF  [SMD_CAP_0402(1005)_N]  (hidden comment: CC0402KRX5R6BB104)
C13  Capacitance: 100nF  [SMD_CAP_0402(1005)_N]  (hidden comment: CC0402KRX5R6BB104)
J7  X05B20L22T  [X05B20L22T]
J8  HDMI-001  [HDMI-001]
R116  Resistance: 10K  [SMD_RES_0402(1005)_N]  (hidden comment: RC0402FR-0710KL)
R117  Resistance: 10K  [SMD_RES_0402(1005)_N]  (hidden comment: RC0402FR-0710KL)

### Ports
DSI (harness MIPI_DSI_4L), HDMI (harness HDMI), I2C_DSI (harness I2C)

### Harnesses
HDMI: CLK_P, CLK_N, D0_P, D0_N, D2_N, D2_P, D1_N, D1_P, CEC, HPD, SDA, SCL
I2C: SCL, SDA
MIPI_DSI_4L: D1_N, D1_P, D0_P, D0_N, CLK_P, CLK_N, D2_N, D2_P, D3_N, D3_P

### Nets
3V3: C12.2 J7.1 R116.2 R117.2
5V: C13.2 J8.18(5V)
GND: C12.1 C13.1 J7.4 J7.7 J7.10 J7.13 J7.16 J7.19 J7.22 J7.MNT1 J7.MNT2 J8.2(D2_SHLD) J8.5(D1_SHLD) J8.8(D0_SHLD) J8.11(CLK_SHLD) J8.17(GND)
DSI_C_N: J7.15 ; port DSI.CLK_N  [project net DSI0.CLK_N]
DSI_C_P: J7.14 ; port DSI.CLK_P  [project net DSI0.CLK_P]
DSI_D0_N: J7.21 ; port DSI.D0_N  [project net DSI0.D0_N]
DSI_D0_P: J7.20 ; port DSI.D0_P  [project net DSI0.D0_P]
DSI_D1_N: J7.18 ; port DSI.D1_N  [project net DSI0.D1_N]
DSI_D1_P: J7.17 ; port DSI.D1_P  [project net DSI0.D1_P]
DSI_D2_N: J7.12 ; port DSI.D2_N  [project net DSI0.D2_N]
DSI_D2_P: J7.11 ; port DSI.D2_P  [project net DSI0.D2_P]
DSI_D3_N: J7.9 ; port DSI.D3_N  [project net DSI0.D3_N]
DSI_D3_P: J7.8 ; port DSI.D3_P  [project net DSI0.D3_P]
HDMI_CEC: J8.13(CEC) ; port HDMI.CEC  [project net HDMI.CEC]
HDMI_CLK_N: J8.12(CLK_M) ; port HDMI.CLK_N  [project net HDMI.CLK_N]
HDMI_CLK_P: J8.10(CLK_P) ; port HDMI.CLK_P  [project net HDMI.CLK_P]
HDMI_HOTPLUG: J8.19(HPD) ; port HDMI.HPD  [project net HDMI.HPD]
HDMI_SCL: J8.15(SCL) ; port HDMI.SCL  [project net HDMI.SCL]
HDMI_SDA: J8.16(SDA) ; port HDMI.SDA  [project net HDMI.SDA]
HDMI_TX0_N: J8.9(D0_M) ; port HDMI.D0_N  [project net HDMI.D0_N]
HDMI_TX0_P: J8.7(D0_P) ; port HDMI.D0_P  [project net HDMI.D0_P]
HDMI_TX1_N: J8.6(D1_M) ; port HDMI.D1_N  [project net HDMI.D1_N]
HDMI_TX1_P: J8.4(D1_P) ; port HDMI.D1_P  [project net HDMI.D1_P]
HDMI_TX2_N: J8.3(D2_M) ; port HDMI.D2_N  [project net HDMI.D2_N]
HDMI_TX2_P: J8.1(D2_P) ; port HDMI.D2_P  [project net HDMI.D2_P]
I2C_DSI_SCL: J7.3 R116.1 ; port I2C_DSI.SCL  [project net I2C0.SCL]
I2C_DSI_SDA: J7.2 R117.1 ; port I2C_DSI.SDA  [project net I2C0.SDA]

Not connected (* = marked no-connect by the designer): J7 5* 6*; J8 14(RESV)*

### Buses and harness runs
harness HDMI = port HDMI
harness I2C_DSI = port I2C_DSI

### Notes on the sheet
- Touch Display over DSI
- Full Size HDMI
- FILE NAME
- PROJECT
- TITLE
- REV
- AUTHOR
- SIZE
- SHEET
- DATE
- OF
- A3

### Library data of the parts
C12 C13 = 100nF 0402 10V 10%: as C14 on sheet OpenPLCv0.2.0_1Wire; Package: 0402; Tolerance: 10%; Voltage Rating: 10V
J7 = X05B20L22T: 22 0.020"（0.50mm） 0.079"（2.00mm） Slide Lock Contact,Bottom SMD,P=0.5mm FFC, FPC Connectors ROHS
J8 = HDMI-001: BOOMELE(Boom Precision Elec) HDMIconnector 19 Female Horizontal SMD Audio & Video Connectors RoHS
R116 R117 = 10K 0402 1% 1/16W: as R26 on sheet OpenPLCv0.2.0_AnalogueInput; Package: 0402; Tolerance: 1%; Power Rating: 1/16W

## Sheet OpenPLCv0.2.0_Etherent.SchDoc
size 420 x 297 mm; PageSetup: Record=PageOptions|CenterHorizontal=True|CenterVertical=True|PrintScale=1.01|XCorrection=1.00|YCorrection=1.00|PrintKind=1|BorderSize=5000000|LeftOffset=0|BottomOffset=0|Orientation=2|PaperLength=1000|PaperWidth=1000|Scale=100|PaperSource=7|PrintQuality=-4|MediaType=1|DitherType=10|PaperKind=A3|PrintScaleMode=1; DocumentNumber: 9; SheetNumber: 9; SheetTotal: 22; SheetTitle: Ethernet
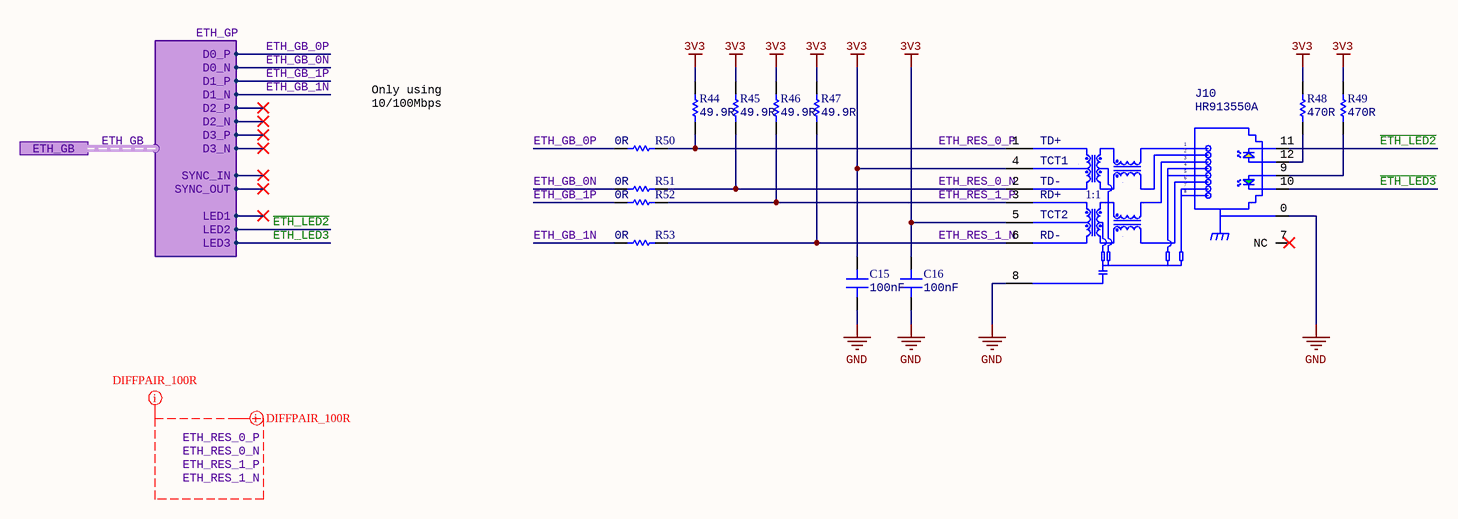
[diagram p18: OpenPLCv0.2.0_Etherent.SchDoc]

### Parts
C15  Capacitance: 100nF  [SMD_CAP_0402(1005)_N]  (hidden comment: CC0402KRX5R9BB104)
C16  Capacitance: 100nF  [SMD_CAP_0402(1005)_N]  (hidden comment: CC0402KRX5R9BB104)
J10  HR913550A  [HR913550A]
R44  Resistance: 49.9R  [SMD_RES_0402(1005)_N]  (hidden comment: RC0402FR-0749R9L)
R45  Resistance: 49.9R  [SMD_RES_0402(1005)_N]  (hidden comment: RC0402FR-0749R9L)
R46  Resistance: 49.9R  [SMD_RES_0402(1005)_N]  (hidden comment: RC0402FR-0749R9L)
R47  Resistance: 49.9R  [SMD_RES_0402(1005)_N]  (hidden comment: RC0402FR-0749R9L)
R48  Resistance: 470R  [SMD_RES_0402(1005)_N]  (hidden comment: RC0402FR-07470RL)
R49  Resistance: 470R  [SMD_RES_0402(1005)_N]  (hidden comment: RC0402FR-07470RL)
R50  Resistance: 0R  [SMD_RES_0402(1005)_N]  (hidden comment: RC0402FR-070RL)
R51  Resistance: 0R  [SMD_RES_0402(1005)_N]  (hidden comment: RC0402FR-070RL)
R52  Resistance: 0R  [SMD_RES_0402(1005)_N]  (hidden comment: RC0402FR-070RL)
R53  Resistance: 0R  [SMD_RES_0402(1005)_N]  (hidden comment: RC0402FR-070RL)

### Ports
ETH_GB (harness ETH_GP)

### Harnesses
ETH_GP: D0_P, D0_N, D1_P, D1_N, D2_P, D2_N, D3_P, D3_N, SYNC_IN, SYNC_OUT, LED1, LED2, LED3

### Nets
3V3: C15.2 C16.2 J10.4(TCT1) J10.5(TCT2) R44.2 R45.2 R46.2 R47.2 R48.2 R49.2
GND: C15.1 C16.1 J10.0(SHLD) J10.8(GND)
~{ETH_LED2}: J10.11(YLED-) ; port ETH_GB.LED2
~{ETH_LED3}: J10.10(GLED+) ; port ETH_GB.LED3
ETH_GB_0N: R51.1 ; port ETH_GB.D0_N  [project net ETH_GB.D0_N]
ETH_GB_0P: R50.1 ; port ETH_GB.D0_P  [project net ETH_GB.D0_P]
ETH_GB_1N: R53.1 ; port ETH_GB.D1_N  [project net ETH_GB.D1_N]
ETH_GB_1P: R52.1 ; port ETH_GB.D1_P  [project net ETH_GB.D1_P]
ETH_RES_0_N: J10.2(TD-) R45.1 R51.2
ETH_RES_0_P: J10.1(TD+) R44.1 R50.2
ETH_RES_1_N: J10.6(RD-) R47.1 R53.2
ETH_RES_1_P: J10.3(RD+) R46.1 R52.2
NetJ10_9: J10.9(OLED+) R49.1
NetJ10_12: J10.12(YLED+) R48.1

Not connected (* = marked no-connect by the designer): J10 7(NC)*

### Buses and harness runs
harness ETH_GB = port ETH_GB

### Layout directives
differential pair; differential pair class 100R_DIFF_PAIRS; net class 100R_PAIRS: ETH_RES_0_N, ETH_RES_0_P, ETH_RES_1_N, ETH_RES_1_P
mark named DIFFPAIR_100R: ETH_RES_0_N, ETH_RES_0_P, ETH_RES_1_N, ETH_RES_1_P

### Notes on the sheet
- Only using 10/100Mbps
- Labels drawn without touching a wire or pin: ETH_RES_0_N, ETH_RES_0_P, ETH_RES_1_N, ETH_RES_1_P
- FILE NAME
- PROJECT
- TITLE
- REV
- AUTHOR
- SIZE
- SHEET
- DATE
- OF
- A3
- (in symbol HR913550A) 1:1

### Library data of the parts
C15 C16 = 100nF 0402 50V 10%: as C63 on sheet OpenPLCv0.2.0_AnalogueInput; Package: 0402; Tolerance: 10%; Voltage Rating: 50V
J10 = HR913550A: RJ45 12 1 Green - Yellow Through Hole Ethernet Connectors/Modular Connectors (RJ45 RJ11) RoHS
R44-R47 = 49R9 0402 1% 1/16W: as R120 on sheet OpenPLCv0.2.0_SDCard; Package: 0402; Tolerance: 1%; Power Rating: 1/16W
R48 R49 = 470R 0402 1% 1W: as R57 on sheet OpenPLCv0.2.0_Power; Package: 0402; Tolerance: 1%
R50-R53 = 0R 0402 1% 1/16W: 0Ω ±1% 1/16W 0402 Chip Resistor - Surface Mount RoHS; Package: 0402; Tolerance: 1%; Power Rating: 1/16W

## Sheet OpenPLCv0.2.0_USBPortTypeA.SchDoc
size 420 x 297 mm; PageSetup: Record=PageOptions|CenterHorizontal=True|CenterVertical=True|PrintScale=1.01|XCorrection=1.00|YCorrection=1.00|PrintKind=1|BorderSize=5000000|LeftOffset=0|BottomOffset=0|Orientation=2|PaperLength=1000|PaperWidth=1000|Scale=100|PaperSource=7|PrintQuality=-4|MediaType=1|DitherType=10|PaperKind=A3|PrintScaleMode=1; DocumentNumber: 10; SheetNumber: 10; SheetTotal: 22; SheetTitle: USB Type-A
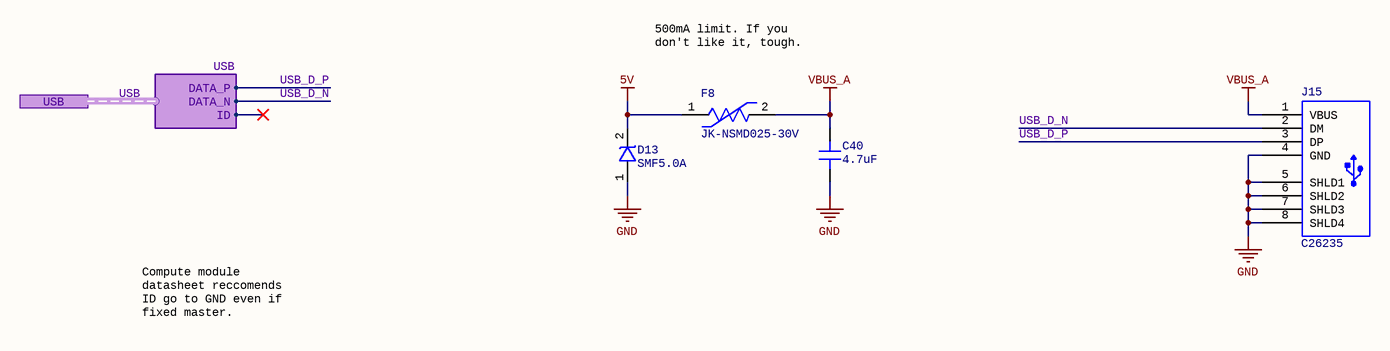
[diagram p19: OpenPLCv0.2.0_USBPortTypeA.SchDoc]

### Parts
C40  Capacitance: 4.7uF  [SMD_CAP_0603(0201)_N]  (hidden comment: CC0603KRX5R6BB475)
D13  SMF5.0A  [SOD-123FL]
F8  JK-NSMD025-30V  [SMD_RES_1206(3216)_N]
J15  C26235  [C26235]

### Ports
USB (harness USB)

### Harnesses
USB: DATA_P, DATA_N, ID

### Nets
5V: D13.2(CATHODE) F8.1
GND: C40.1 D13.1(ANODE) J15.4(GND) J15.5(SHLD1) J15.6(SHLD2) J15.7(SHLD3) J15.8(SHLD4)
VBUS_A: C40.2 F8.2 J15.1(VBUS)
USB_D_N: J15.2(DM) ; port USB.DATA_N  [project net USB.DATA_N]
USB_D_P: J15.3(DP) ; port USB.DATA_P  [project net USB.DATA_P]

### Buses and harness runs
harness USB = port USB

### Notes on the sheet
- (near F8) 500mA limit. If you don't like it, tough.
- Compute module datasheet reccomends ID go to GND even if fixed master.
- FILE NAME
- PROJECT
- TITLE
- REV
- AUTHOR
- SIZE
- SHEET
- DATE
- OF
- A3

### Library data of the parts
C40 = 4.7uF 0603 10V 10%: as C53 on sheet OpenPLCv0.2.0_USBPortTypeB; Package: 0603; Tolerance: 10%; Voltage Rating: 10V
D13 = SMF5.0A: Unidirectional 5V 6.4V 9.2V 21.8A SMF(SOD123FL) TVS RoHS
F8 = JK-NSMD025-30V: Polymeric 30V 500mA 0.08s 700mΩ 1206 PTC Resettable Fuses RoHS
J15 = C26235: USB - Type A Female USB 2 4 Through Hole USB Connectors RoHS

## Sheet OpenPLCv0.2.0_SerialInterface.SchDoc
size 420 x 297 mm; PageSetup: Record=PageOptions|CenterHorizontal=True|CenterVertical=True|PrintScale=1.01|XCorrection=1.00|YCorrection=1.00|PrintKind=1|BorderSize=5000000|LeftOffset=0|BottomOffset=0|Orientation=2|PaperLength=1000|PaperWidth=1000|Scale=100|PaperSource=7|PrintQuality=-4|MediaType=1|DitherType=10|PaperKind=A3|PrintScaleMode=1; DocumentNumber: 14; SheetNumber: 14; SheetTotal: 22; SheetTitle: USB Serial Interface
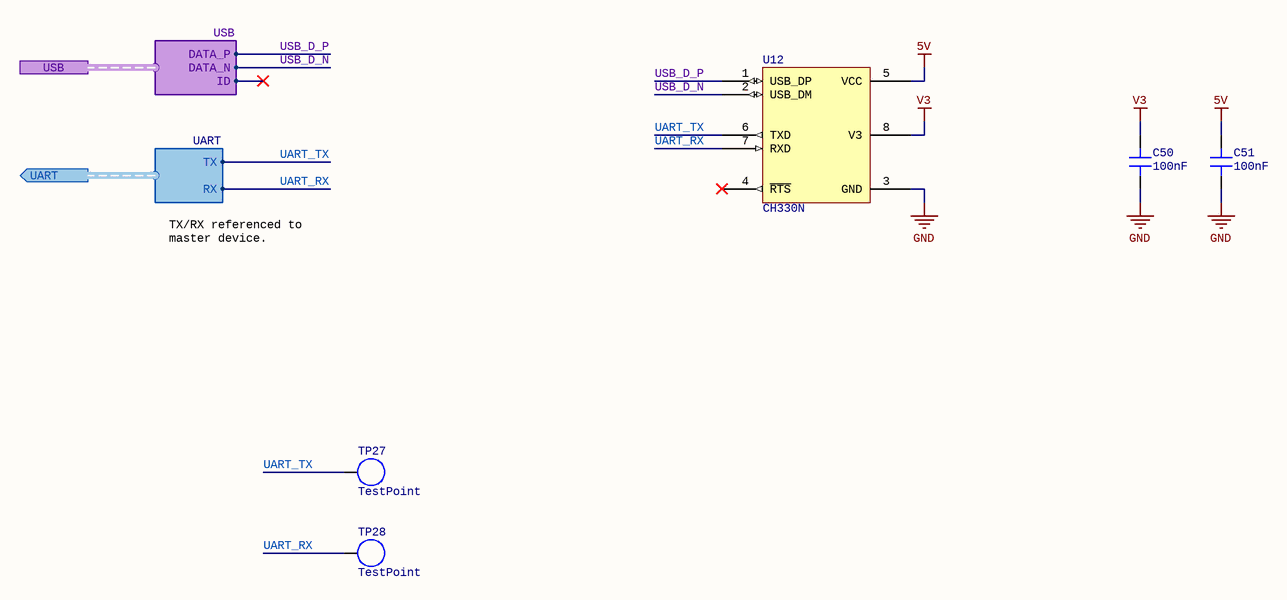
[diagram p20: OpenPLCv0.2.0_SerialInterface.SchDoc]

### Parts
C50  Capacitance: 100nF  [SMD_CAP_0402(1005)_N]  (hidden comment: CC0402KRX5R6BB104)
C51  Capacitance: 100nF  [SMD_CAP_0402(1005)_N]  (hidden comment: CC0402KRX5R6BB104)
TP27  TestPoint  [Pad]  (no BOM)
TP28  TestPoint  [Pad]  (no BOM)
U12  CH330N  [SOIC-8-3.9mm]

### Ports
UART (out, harness UART), USB (harness USB)

### Harnesses
USB: DATA_P, DATA_N, ID
UART: TX, RX

### Nets
5V: C51.2 U12.5(VCC)
GND: C50.1 C51.1 U12.3(GND)
V3: C50.2 U12.8(V3)
UART_RX: TP28.1 U12.7(RXD) ; port UART.RX  [project net GPIO15]
UART_TX: TP27.1 U12.6(TXD) ; port UART.TX  [project net GPIO14]
USB_D_N: U12.2(USB_DM) ; port USB.DATA_N  [project net USB_2_D_N]
USB_D_P: U12.1(USB_DP) ; port USB.DATA_P  [project net USB_2_D_P]

Not connected (* = marked no-connect by the designer): U12 4(~{RTS})*

### Notes on the sheet
- TX/RX referenced to master device.
- FILE NAME
- PROJECT
- TITLE
- REV
- AUTHOR
- SIZE
- SHEET
- DATE
- OF
- A3

### Library data of the parts
C50 C51 = 100nF 0402 10V 10%: as C14 on sheet OpenPLCv0.2.0_1Wire; Package: 0402; Tolerance: 10%; Voltage Rating: 10V
TP27 TP28 = Test point
U12 = CH330N: Transceiver USB 2.0 2Mbps SOP-8_150mil USB ICs RoHS

## Sheet OpenPLCv0.2.0_USBSwitch.SchDoc
size 420 x 297 mm; PageSetup: Record=PageOptions|CenterHorizontal=True|CenterVertical=True|PrintScale=1.01|XCorrection=1.00|YCorrection=1.00|PrintKind=1|BorderSize=5000000|LeftOffset=0|BottomOffset=0|Orientation=2|PaperLength=1000|PaperWidth=1000|Scale=100|PaperSource=7|PrintQuality=-4|MediaType=1|DitherType=10|PaperKind=A3|PrintScaleMode=1; DocumentNumber: 15; SheetNumber: 15; SheetTotal: 22; SheetTitle: USB Mux
Used 2 times, as channels USBMUX1, USBMUX2. Parts and nets are listed once, with the designators drawn on the sheet.
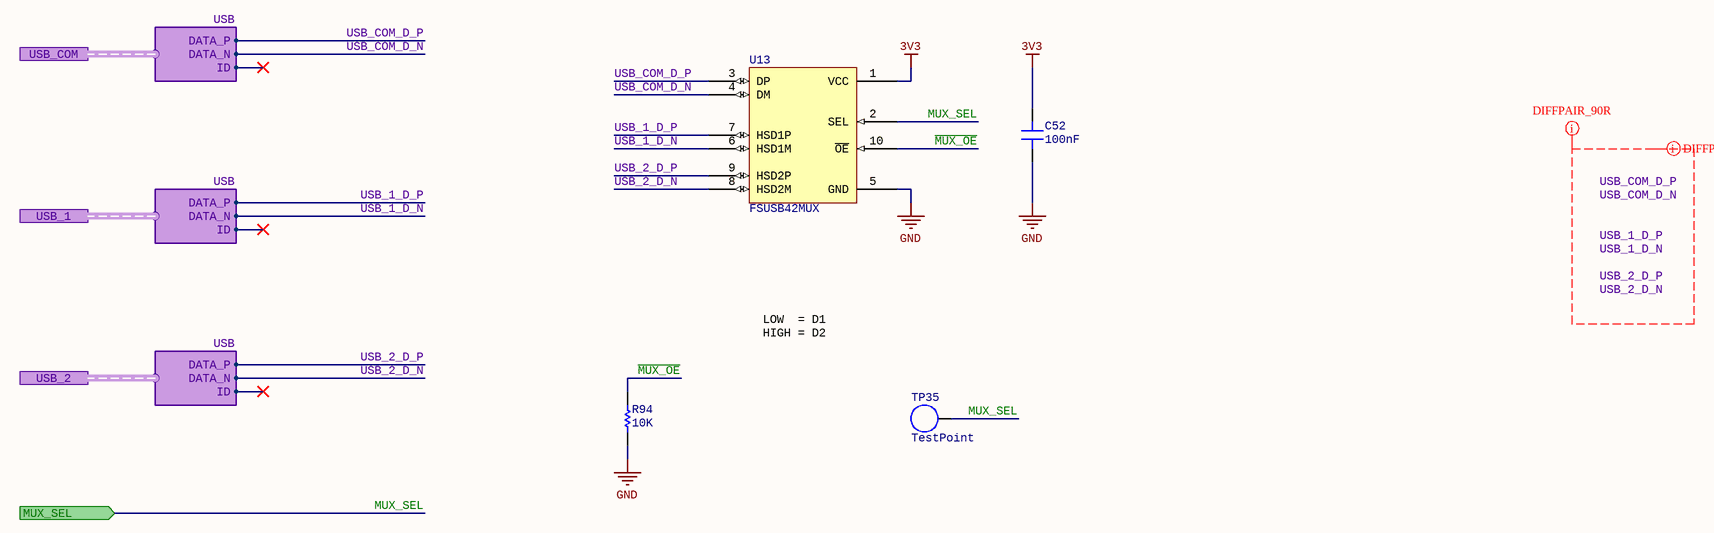
[diagram p21: OpenPLCv0.2.0_USBSwitch.SchDoc]

### Parts
C52  Capacitance: 100nF  [SMD_CAP_0402(1005)_N]  (hidden comment: CC0402KRX5R6BB104)
R94  Resistance: 10K  [SMD_RES_0402(1005)_N]  (hidden comment: RC0402FR-0710KL)
TP35  TestPoint  [Pad]  (no BOM)
U13  FSUSB42MUX  [MSOP-10]

### Ports
MUX_SEL (in), USB_1 (harness USB), USB_2 (harness USB), USB_COM (harness USB)

### Harnesses
USB: DATA_P, DATA_N, ID

### Nets
3V3: C52.2 U13.1(VCC)
GND: C52.1 R94.1 U13.5(GND)
~{MUX_OE}: R94.2 U13.10(~{OE})
MUX_SEL: TP35.1 U13.2(SEL) ; port MUX_SEL
USB_1_D_N: U13.6(HSD1M) ; port USB_1.DATA_N
USB_1_D_P: U13.7(HSD1P) ; port USB_1.DATA_P
USB_2_D_N: U13.8(HSD2M) ; port USB_2.DATA_N
USB_2_D_P: U13.9(HSD2P) ; port USB_2.DATA_P
USB_COM_D_N: U13.4(DM) ; port USB_COM.DATA_N
USB_COM_D_P: U13.3(DP) ; port USB_COM.DATA_P

### Channels
USBMUX1: designators end in _1; ports MUX_SEL=MUX_SEL
USBMUX2: designators end in _2; ports MUX_SEL=MUX_SEL

### Layout directives
differential pair; differential pair class 90R_DIFF_PAIRS; net class 90R_PAIRS: USB_1_D_N, USB_1_D_P, USB_2_D_N, USB_2_D_P, USB_COM_D_N, USB_COM_D_P
mark named DIFFPAIR_90R: USB_1_D_N, USB_1_D_P, USB_2_D_N, USB_2_D_P, USB_COM_D_N, USB_COM_D_P

### Notes on the sheet
- LOW  = D1
  HIGH = D2
- Labels drawn without touching a wire or pin: USB_1_D_N, USB_1_D_P, USB_2_D_N, USB_2_D_P, USB_COM_D_N, USB_COM_D_P
- FILE NAME
- PROJECT
- TITLE
- REV
- AUTHOR
- SIZE
- SHEET
- DATE
- OF
- A3

### Library data of the parts
C52 = 100nF 0402 10V 10%: as C14 on sheet OpenPLCv0.2.0_1Wire; Package: 0402; Tolerance: 10%; Voltage Rating: 10V
R94 = 10K 0402 1% 1/16W: as R26 on sheet OpenPLCv0.2.0_AnalogueInput; Package: 0402; Tolerance: 1%; Power Rating: 1/16W
TP35 = Test point
U13 = FSUSB42MUX: MSOP-10 USB ICs RoHS